# EAGLE schematic homecontroller_main_new (EAGLE 6.6.0)

## Sheet 1 of 7
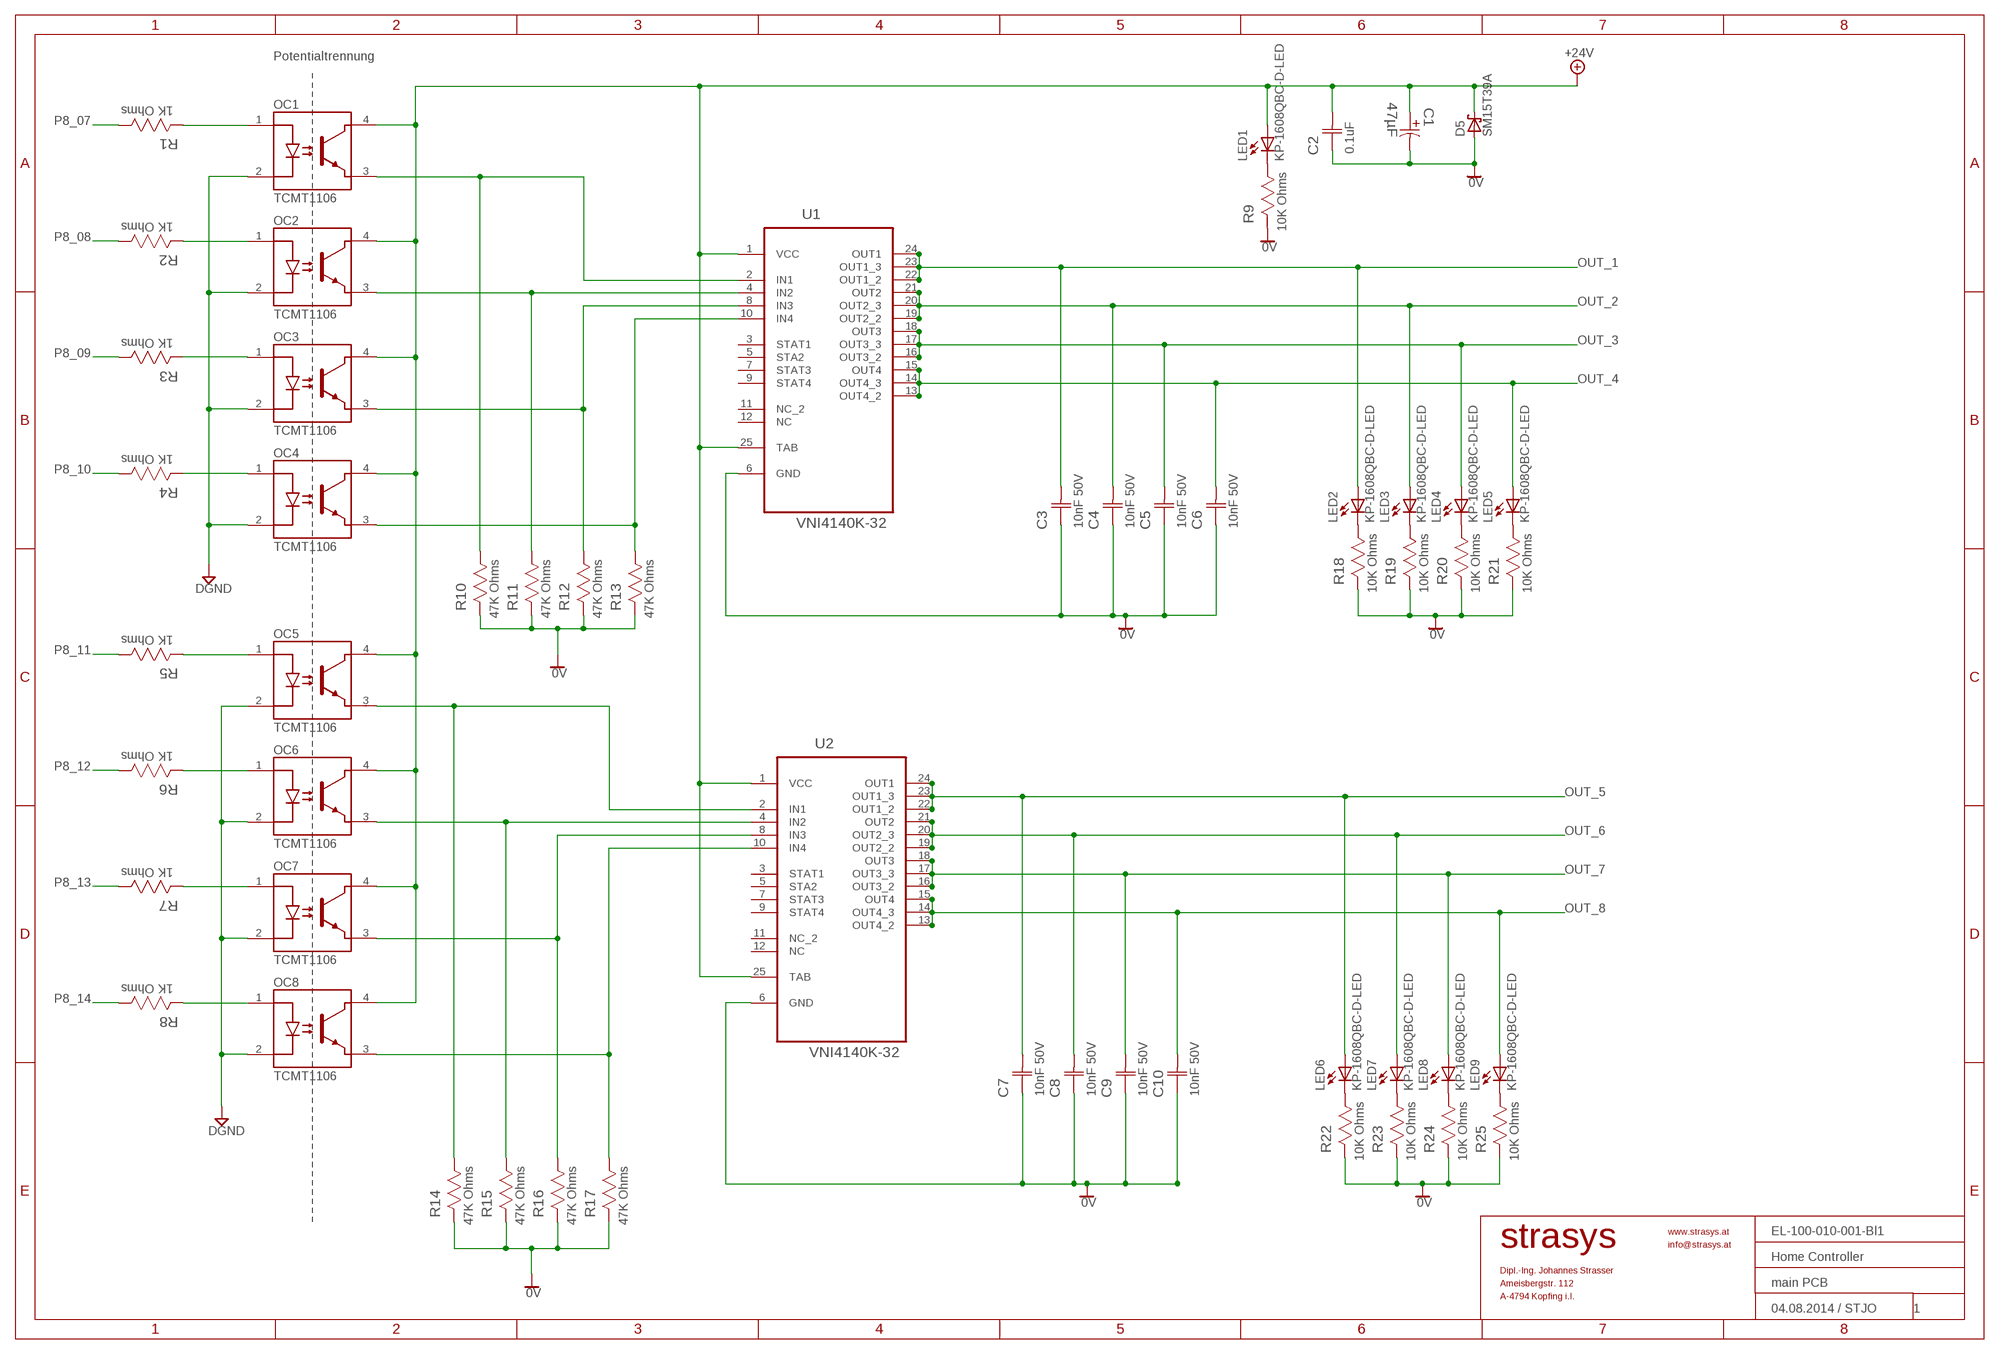
[diagram p0: schematic, sheet 1]
FRAME1 (A3L-LOC): DATE_DRAWING: 04.08.2014 / STJO; DRAWING_NAME1: Home Controller; DRAWING_NAME2: main PCB; DRAWING_NO: EL-100-010-001-Bl1; PAGE: 1

### Parts
C1  47µF  EEE-FK1H470P-CASE-E  [CAPAE830X650N]
C2  0.1uF  C0603C104K5RAC-TU  [CAPC1608X85N]
C3  10nF 50V  C0603C103K5RACTU  [CAPC1608X85N]
C4  10nF 50V  C0603C103K5RACTU  [CAPC1608X85N]
C5  10nF 50V  C0603C103K5RACTU  [CAPC1608X85N]
C6  10nF 50V  C0603C103K5RACTU  [CAPC1608X85N]
C7  10nF 50V  C0603C103K5RACTU  [CAPC1608X85N]
C8  10nF 50V  C0603C103K5RACTU  [CAPC1608X85N]
C9  10nF 50V  C0603C103K5RACTU  [CAPC1608X85N]
C10  10nF 50V  C0603C103K5RACTU  [CAPC1608X85N]
D5  SM15T39A  [SM15T39A]
LED1  KP-1608QBC-D-LED  [KP-1608QBCD-D-LED]
LED2  KP-1608QBC-D-LED  [KP-1608QBCD-D-LED]
LED3  KP-1608QBC-D-LED  [KP-1608QBCD-D-LED]
LED4  KP-1608QBC-D-LED  [KP-1608QBCD-D-LED]
LED5  KP-1608QBC-D-LED  [KP-1608QBCD-D-LED]
LED6  KP-1608QBC-D-LED  [KP-1608QBCD-D-LED]
LED7  KP-1608QBC-D-LED  [KP-1608QBCD-D-LED]
LED8  KP-1608QBC-D-LED  [KP-1608QBCD-D-LED]
LED9  KP-1608QBC-D-LED  [KP-1608QBCD-D-LED]
OC1  TCMT1106  [SOP-4]
OC2  TCMT1106  [SOP-4]
OC3  TCMT1106  [SOP-4]
OC4  TCMT1106  [SOP-4]
OC5  TCMT1106  [SOP-4]
OC6  TCMT1106  [SOP-4]
OC7  TCMT1106  [SOP-4]
OC8  TCMT1106  [SOP-4]
R1  1K Ohms  CRCW06031K00FKEA  [RESC1608X60N]
R2  1K Ohms  CRCW06031K00FKEA  [RESC1608X60N]
R3  1K Ohms  CRCW06031K00FKEA  [RESC1608X60N]
R4  1K Ohms  CRCW06031K00FKEA  [RESC1608X60N]
R5  1K Ohms  CRCW06031K00FKEA  [RESC1608X60N]
R6  1K Ohms  CRCW06031K00FKEA  [RESC1608X60N]
R7  1K Ohms  CRCW06031K00FKEA  [RESC1608X60N]
R8  1K Ohms  CRCW06031K00FKEA  [RESC1608X60N]
R9  10K Ohms  CRCW060310K0FKEA  [RESC1608X60N]
R10  47K Ohms  CRCW060347K0FKEA  [RESC1608X60N]
R11  47K Ohms  CRCW060347K0FKEA  [RESC1608X60N]
R12  47K Ohms  CRCW060347K0FKEA  [RESC1608X60N]
R13  47K Ohms  CRCW060347K0FKEA  [RESC1608X60N]
R14  47K Ohms  CRCW060347K0FKEA  [RESC1608X60N]
R15  47K Ohms  CRCW060347K0FKEA  [RESC1608X60N]
R16  47K Ohms  CRCW060347K0FKEA  [RESC1608X60N]
R17  47K Ohms  CRCW060347K0FKEA  [RESC1608X60N]
R18  10K Ohms  CRCW060310K0FKEA  [RESC1608X60N]
R19  10K Ohms  CRCW060310K0FKEA  [RESC1608X60N]
R20  10K Ohms  CRCW060310K0FKEA  [RESC1608X60N]
R21  10K Ohms  CRCW060310K0FKEA  [RESC1608X60N]
R22  10K Ohms  CRCW060310K0FKEA  [RESC1608X60N]
R23  10K Ohms  CRCW060310K0FKEA  [RESC1608X60N]
R24  10K Ohms  CRCW060310K0FKEA  [RESC1608X60N]
R25  10K Ohms  CRCW060310K0FKEA  [RESC1608X60N]
U1  VNI4140K-32  [SOP80P1030X247-25N]
U2  VNI4140K-32  [SOP80P1030X247-25N]

### Nets
0V: C1.2 C2.1(C1) C3.1(C1) C4.1(C1) C5.1(C1) C6.1(C1) C7.1(C1) C8.1(C1) C9.1(C1) C10.1(C1) D5.A R9.2 R10.2 R11.2 R12.2 R13.2 R14.2 R15.2 R16.2 R17.2 R18.2 R19.2 R20.2 R21.2 R22.2 R23.2 R24.2 R25.2 U1.6(GND) U2.6(GND) ; also sheet 2,7
+24V: C1.1 C2.2(C2) D5.K(C) LED1.1 OC1.4 OC2.4 OC3.4 OC4.4 OC5.4 OC6.4 OC7.4 OC8.4 U1.1(VCC) U1.25(TAB) U2.1(VCC) U2.25(TAB) ; also sheet 7
DGND: OC1.2 OC2.2 OC3.2 OC4.2 OC5.2 OC6.2 OC7.2 OC8.2 ; also sheet 2,3,5,6,7
N$1: LED2.2 R18.1
N$2: LED3.2 R19.1
N$3: LED4.2 R20.1
N$4: LED5.2 R21.1
N$5: LED6.2 R22.1
N$6: LED7.2 R23.1
N$7: LED8.2 R24.1
N$8: LED9.2 R25.1
N$9: OC1.3 R10.1 U1.2(IN1)
N$10: OC1.1 R1.2
N$11: OC2.1 R2.2
N$12: OC3.1 R3.2
N$13: OC4.1 R4.2
N$14: LED1.2 R9.1
N$15: OC2.3 R11.1 U1.4(IN2)
N$16: OC3.3 R12.1 U1.8(IN3)
N$17: OC4.3 R13.1 U1.10(IN4)
N$22: OC5.1 R5.2
N$23: OC6.1 R6.2
N$24: OC7.1 R7.2
N$25: OC8.1 R8.2
N$26: OC5.3 R14.1 U2.2(IN1)
N$27: OC6.3 R15.1 U2.4(IN2)
N$28: OC7.3 R16.1 U2.8(IN3)
N$29: OC8.3 R17.1 U2.10(IN4)
OUT_1: C3.2(C2) LED2.1 U1.22(OUT1_2) U1.23(OUT1_3) U1.24(OUT1) ; also sheet 7
OUT_2: C4.2(C2) LED3.1 U1.19(OUT2_2) U1.20(OUT2_3) U1.21(OUT2) ; also sheet 7
OUT_3: C5.2(C2) LED4.1 U1.16(OUT3_2) U1.17(OUT3_3) U1.18(OUT3) ; also sheet 7
OUT_4: C6.2(C2) LED5.1 U1.13(OUT4_2) U1.14(OUT4_3) U1.15(OUT4) ; also sheet 7
OUT_5: C7.2(C2) LED6.1 U2.22(OUT1_2) U2.23(OUT1_3) U2.24(OUT1) ; also sheet 7
OUT_6: C8.2(C2) LED7.1 U2.19(OUT2_2) U2.20(OUT2_3) U2.21(OUT2) ; also sheet 7
OUT_7: C9.2(C2) LED8.1 U2.16(OUT3_2) U2.17(OUT3_3) U2.18(OUT3) ; also sheet 7
OUT_8: C10.2(C2) LED9.1 U2.13(OUT4_2) U2.14(OUT4_3) U2.15(OUT4) ; also sheet 7
P8_07: R1.1 ; also sheet 7
P8_08: R2.1 ; also sheet 7
P8_09: R3.1 ; also sheet 7
P8_10: R4.1 ; also sheet 7
P8_11: R5.1 ; also sheet 7
P8_12: R6.1 ; also sheet 7
P8_13: R7.1 ; also sheet 7
P8_14: R8.1 ; also sheet 7
Unconnected: U1.3(STAT1) U1.5(STA2) U1.7(STAT3) U1.9(STAT4) U1.11(NC_2) U1.12(NC) U2.3(STAT1) U2.5(STA2) U2.7(STAT3) U2.9(STAT4) U2.11(NC_2) U2.12(NC)

### Notes on the sheet
- Potentialtrennung

## Sheet 2 of 7
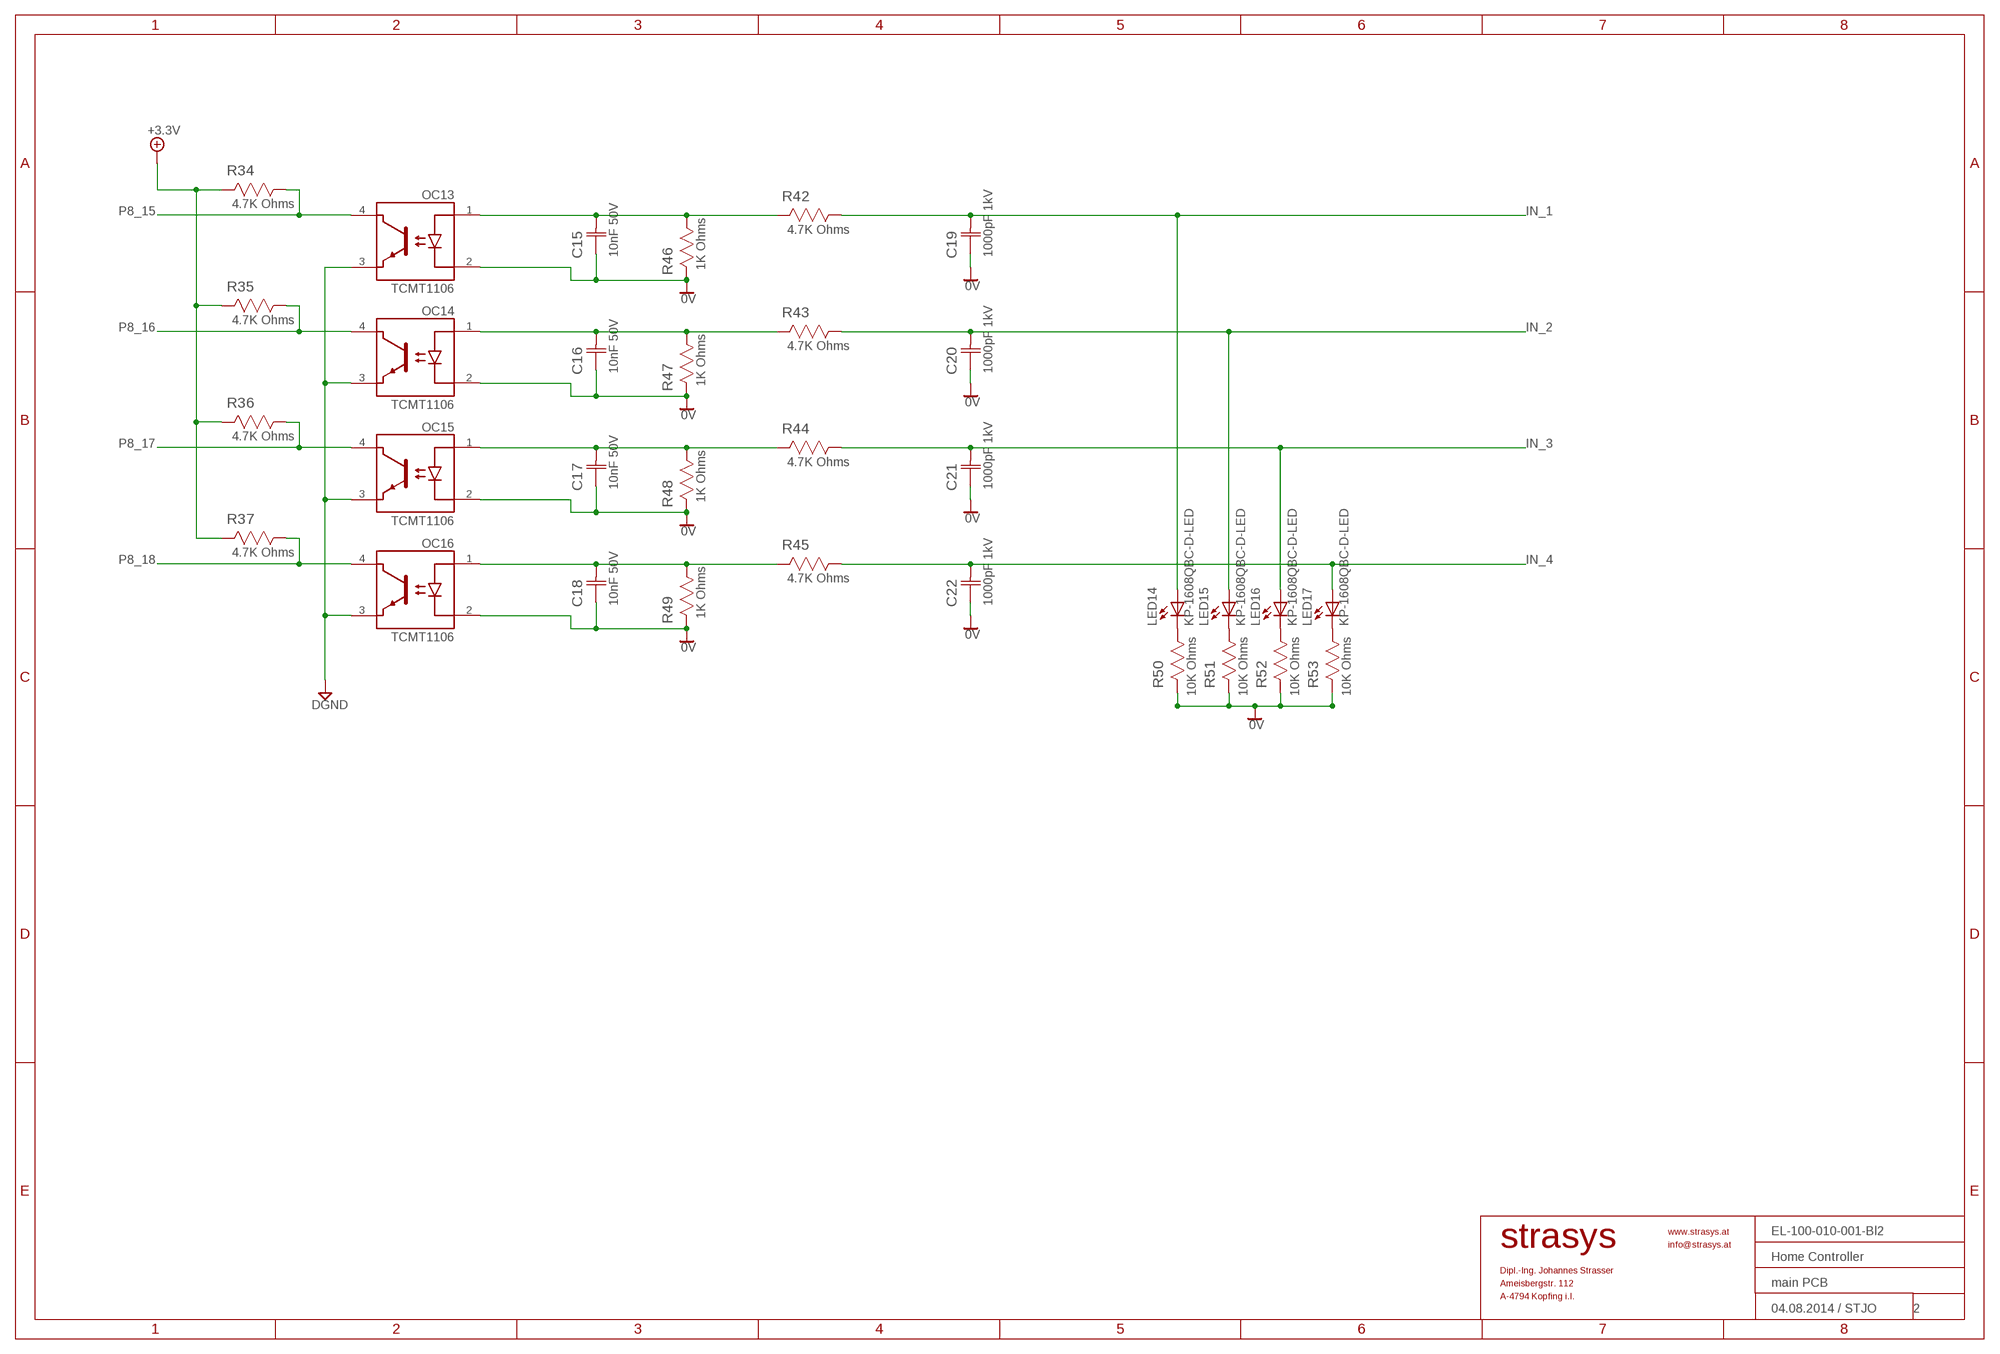
[diagram p1: schematic, sheet 2]
FRAME2 (A3L-LOC): DATE_DRAWING: 04.08.2014 / STJO; DRAWING_NAME1: Home Controller; DRAWING_NAME2: main PCB; DRAWING_NO: EL-100-010-001-Bl2; PAGE: 2

### Parts
C15  10nF 50V  C0603C103K5RACTU  [CAPC1608X85N]
C16  10nF 50V  C0603C103K5RACTU  [CAPC1608X85N]
C17  10nF 50V  C0603C103K5RACTU  [CAPC1608X85N]
C18  10nF 50V  C0603C103K5RACTU  [CAPC1608X85N]
C19  1000pF 1kV  C1206C102KDRACTU  [CAPC3216X88N]
C20  1000pF 1kV  C1206C102KDRACTU  [CAPC3216X88N]
C21  1000pF 1kV  C1206C102KDRACTU  [CAPC3216X88N]
C22  1000pF 1kV  C1206C102KDRACTU  [CAPC3216X88N]
LED14  KP-1608QBC-D-LED  [KP-1608QBCD-D-LED]
LED15  KP-1608QBC-D-LED  [KP-1608QBCD-D-LED]
LED16  KP-1608QBC-D-LED  [KP-1608QBCD-D-LED]
LED17  KP-1608QBC-D-LED  [KP-1608QBCD-D-LED]
OC13  TCMT1106  [SOP-4]
OC14  TCMT1106  [SOP-4]
OC15  TCMT1106  [SOP-4]
OC16  TCMT1106  [SOP-4]
R34  4.7K Ohms  CRCW06034K70FKEA  [RESC1608X60N]
R35  4.7K Ohms  CRCW06034K70FKEA  [RESC1608X60N]
R36  4.7K Ohms  CRCW06034K70FKEA  [RESC1608X60N]
R37  4.7K Ohms  CRCW06034K70FKEA  [RESC1608X60N]
R42  4.7K Ohms  CRCW06034K70FKEA  [RESC1608X60N]
R43  4.7K Ohms  CRCW06034K70FKEA  [RESC1608X60N]
R44  4.7K Ohms  CRCW06034K70FKEA  [RESC1608X60N]
R45  4.7K Ohms  CRCW06034K70FKEA  [RESC1608X60N]
R46  1K Ohms  CRCW06031K00FKEA  [RESC1608X60N]
R47  1K Ohms  CRCW06031K00FKEA  [RESC1608X60N]
R48  1K Ohms  CRCW06031K00FKEA  [RESC1608X60N]
R49  1K Ohms  CRCW06031K00FKEA  [RESC1608X60N]
R50  10K Ohms  CRCW060310K0FKEA  [RESC1608X60N]
R51  10K Ohms  CRCW060310K0FKEA  [RESC1608X60N]
R52  10K Ohms  CRCW060310K0FKEA  [RESC1608X60N]
R53  10K Ohms  CRCW060310K0FKEA  [RESC1608X60N]

### Nets
0V: C15.1(C1) C16.1(C1) C17.1(C1) C18.1(C1) C19.1(C1) C20.1(C1) C21.1(C1) C22.1(C1) OC13.2 OC14.2 OC15.2 OC16.2 R46.2 R47.2 R48.2 R49.2 R50.2 R51.2 R52.2 R53.2 ; also sheet 1,7
+3.3V: R34.2 R35.2 R36.2 R37.2 ; also sheet 3,5,6,7
DGND: OC13.3 OC14.3 OC15.3 OC16.3 ; also sheet 1,3,5,6,7
IN_1: C19.2(C2) LED14.1 R42.1 ; also sheet 7
IN_2: C20.2(C2) LED15.1 R43.1 ; also sheet 7
IN_3: C21.2(C2) LED16.1 R44.1 ; also sheet 7
IN_4: C22.2(C2) LED17.1 R45.1 ; also sheet 7
N$30: LED14.2 R50.1
N$31: LED15.2 R51.1
N$32: LED16.2 R52.1
N$33: LED17.2 R53.1
N$34: C15.2(C2) OC13.1 R42.2 R46.1
N$36: C16.2(C2) OC14.1 R43.2 R47.1
N$42: C17.2(C2) OC15.1 R44.2 R48.1
N$49: C18.2(C2) OC16.1 R45.2 R49.1
P8_15: OC13.4 R34.1 ; also sheet 7
P8_16: OC14.4 R35.1 ; also sheet 7
P8_17: OC15.4 R36.1 ; also sheet 7
P8_18: OC16.4 R37.1 ; also sheet 7

## Sheet 3 of 7
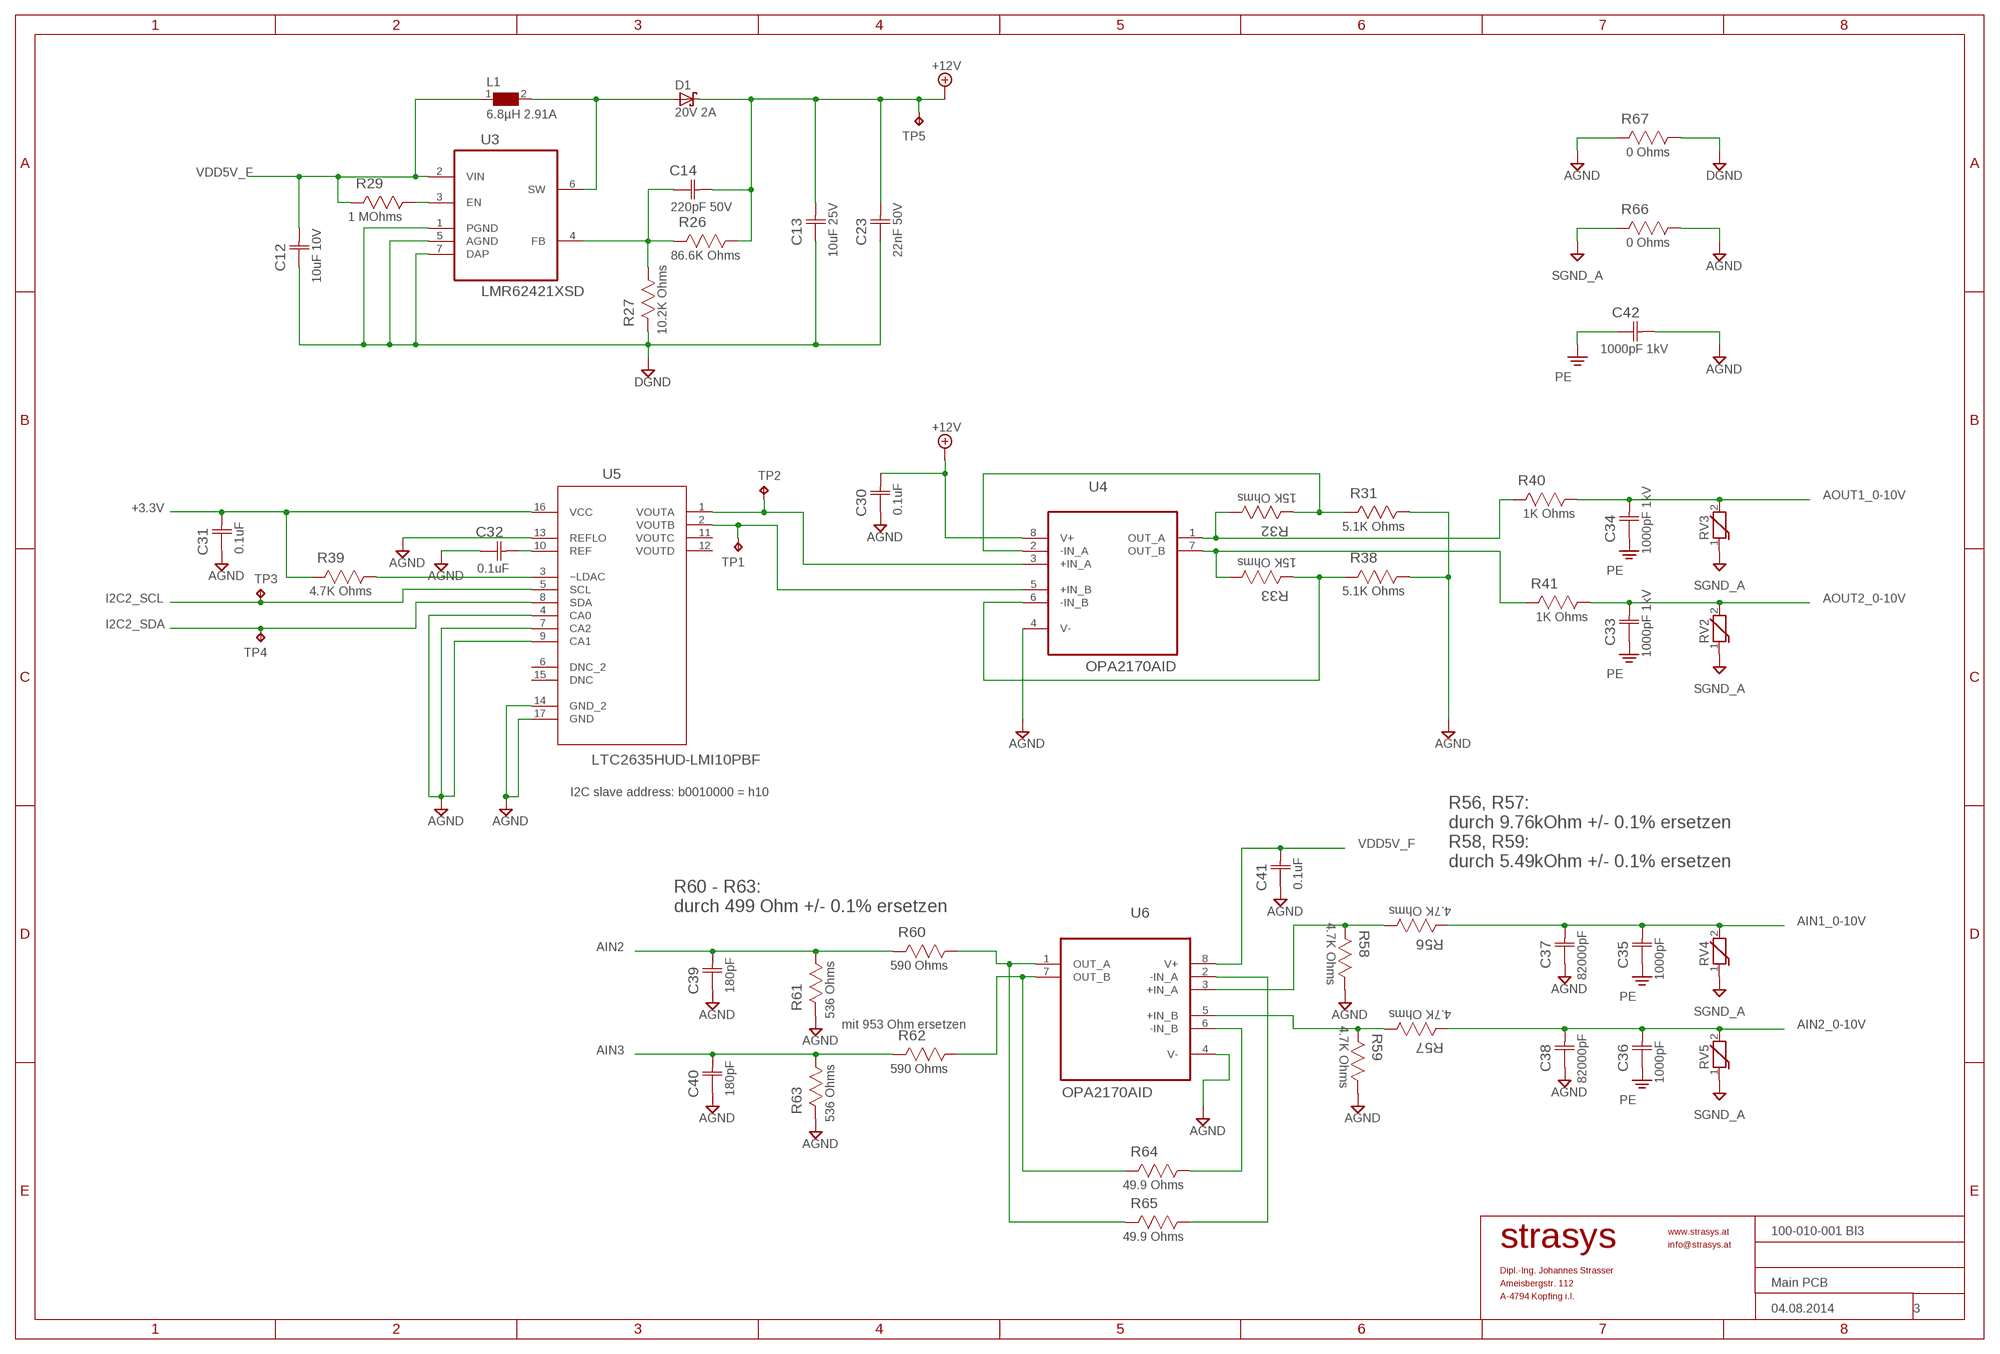
[diagram p2: schematic, sheet 3]
FRAME4 (A3L-LOC): DATE_DRAWING: 04.08.2014; DRAWING_NAME1: Home Controller; DRAWING_NAME2: Main PCB; DRAWING_NO: 100-010-001 Bl3; PAGE: 3

### Parts
C12  10uF 10V  C0805C106K8PACTU  [CAPC2013X140N]
C13  10uF 25V  C1206C106K3PACTU  [CAPC3216X180N]
C14  220pF 50V  C0603C221J5GACTU  [CAPC1608X85N]
C23  22nF 50V  C0603C223K5RACTU  [CAPC1608X85N]
C30  0.1uF  C0603C104K5RAC-TU  [CAPC1608X85N]
C31  0.1uF  C0603C104K5RAC-TU  [CAPC1608X85N]
C32  0.1uF  C0603C104K5RAC-TU  [CAPC1608X85N]
C33  1000pF 1kV  C1206C102KDRACTU  [CAPC3216X88N]
C34  1000pF 1kV  C1206C102KDRACTU  [CAPC3216X88N]
C35  1000pF  C1206C102KDRACTU  [CAPC3216X88N]
C36  1000pF  C1206C102KDRACTU  [CAPC3216X88N]
C37  82000pF  C0603C823K5RACTU  [CAPC1608X85N]
C38  82000pF  C0603C823K5RACTU  [CAPC1608X85N]
C39  180pF  C0603C181J2GACTU  [CAPC1608X85N]
C40  180pF  C0603C181J2GACTU  [CAPC1608X85N]
C41  0.1uF  C0603C104K5RAC-TU  [CAPC1608X85N]
C42  1000pF 1kV  C1206C102KDRACTU  [CAPC3216X88N]
D1  20V 2A  SCHOTTKY-DIODESMD  [SMB]
L1  6.8µH 2.91A  WE-PD-7447779006_7332/7345_PLASTIC_BASE  [WE-PD_7332/7345_PLASTIC_BASE]
R26  86.6K Ohms  CRCW060386K6FKEA  [RESC1608X60N]
R27  10.2K Ohms  CRCW060310K2FKEA  [RESC1608X60N]
R29  1 MOhms  CRCW06031M00FKEA  [RESC1608X60N]
R31  5.1K Ohms  CRCW06035K10FKEA  [RESC1608X60N]
R32  15K Ohms  CRCW060315K0FKEA  [RESC1608X60N]
R33  15K Ohms  CRCW060315K0FKEA  [RESC1608X60N]
R38  5.1K Ohms  CRCW06035K10FKEA  [RESC1608X60N]
R39  4.7K Ohms  CRCW06034K70FKEA  [RESC1608X60N]
R40  1K Ohms  CRCW06031K00FKEA  [RESC1608X60N]
R41  1K Ohms  CRCW06031K00FKEA  [RESC1608X60N]
R56  4.7K Ohms  CRCW06034K70FKEA  [RESC1608X60N]
R57  4.7K Ohms  CRCW06034K70FKEA  [RESC1608X60N]
R58  4.7K Ohms  CRCW06034K70FKEA  [RESC1608X60N]
R59  4.7K Ohms  CRCW06034K70FKEA  [RESC1608X60N]
R60  590 Ohms  CRCW0603590RFKEA  [RESC1608X60N]
R61  536 Ohms  CRCW0603536RFKEA  [RESC1608X60N]
R62  590 Ohms  CRCW0603590RFKEA  [RESC1608X60N]
R63  536 Ohms  CRCW0603536RFKEA  [RESC1608X60N]
R64  49.9 Ohms  CRCW060349R9FKEA  [RESC1608X60N]
R65  49.9 Ohms  CRCW060349R9FKEA  [RESC1608X60N]
R66  0 Ohms  CRCW12060000Z0EA  [RESC3216X71N]
R67  0 Ohms  CRCW12060000Z0EA  [RESC3216X71N]
RV2  WE-VS-82536140_0603  [WESURGE_0603]
RV3  WE-VS-82536140_0603  [WESURGE_0603]
RV4  WE-VS-82536140_0603  [WESURGE_0603]
RV5  WE-VS-82536140_0603  [WESURGE_0603]
TP1  TPB1,27  [B1,27]
TP2  TPB1,27  [B1,27]
TP3  TPB1,27  [B1,27]
TP4  TPB1,27  [B1,27]
TP5  TPB1,27  [B1,27]
U3  LMR62421XSD  [DFN300X300X80-7N]
U4  OPA2170AID  [SOIC127P600X175-8N]
U5  LTC2635HUD-LMI10PBF  [QFN50P300X300X80-17N]
U6  OPA2170AID  [SOIC127P600X175-8N]

### Nets
+3.3V: C31.2(C2) R39.2 U5.16(VCC) ; also sheet 2,5,6,7
+12V: C13.2(C2) C14.2(C2) C23.2(C2) C30.2(C2) D1.C R26.1 TP5.TP U4.8(V+)
AGND: C30.1(C1) C31.1(C1) C32.1(C1) C37.1(C1) C38.1(C1) C39.1(C1) C40.1(C1) C41.1(C1) C42.2(C2) R31.1 R38.1 R58.1 R59.1 R61.2 R63.2 R66.1 R67.2 U4.4(V-) U5.4(CA0) U5.7(CA2) U5.9(CA1) U5.13(REFLO) U5.14(GND_2) U5.17(GND) U6.4(V-) ; also sheet 4,7
AIN1_0-10V: C35.2(C2) C37.2(C2) R56.2 RV4.2 ; also sheet 7
AIN2: C39.2(C2) R60.2 R61.1 ; also sheet 7
AIN2_0-10V: C36.2(C2) C38.2(C2) R57.2 RV5.2 ; also sheet 7
AIN3: C40.2(C2) R62.2 R63.1 ; also sheet 7
AOUT1_0-10V: C34.2(C2) R40.1 RV3.2 ; also sheet 7
AOUT2_0-10V: C33.2(C2) R41.1 RV2.2 ; also sheet 7
DGND: C12.1(C1) C13.1(C1) C23.1(C1) R27.2 R67.1 U3.1(PGND) U3.5(AGND) U3.7(DAP) ; also sheet 1,2,5,6,7
FB_LMR62: C14.1(C1) R26.2 R27.1 U3.4(FB)
I2C2_SCL: TP3.TP U5.5(SCL) ; also sheet 6,7
I2C2_SDA: TP4.TP U5.8(SDA) ; also sheet 6,7
LDAC: R39.1 U5.3(~LDAC)
N$21: R56.1 R58.2 U6.3(+IN_A)
N$39: R29.1 U3.3(EN)
N$45: R57.1 R59.2 U6.5(+IN_B)
N$50: C32.2(C2) U5.10(REF)
OPA21_-IN_A: R31.2 R32.2 U4.2(-IN_A)
OPA21_-IN_B: R33.2 R38.2 U4.6(-IN_B)
OPA21_AOUTB: R33.1 R41.2 U4.7(OUT_B)
OPA21_OUT_A: R32.1 R40.2 U4.1(OUT_A)
OPA2170_-IN_A_2: R65.1 U6.2(-IN_A)
OPA2170_-IN_B_2: R64.1 U6.6(-IN_B)
OPA2170_OUT_A_2: R60.1 R65.2 U6.1(OUT_A)
OPA2170_OUT_B_2: R62.1 R64.2 U6.7(OUT_B)
PE: C33.1(C1) C34.1(C1) C35.1(C1) C36.1(C1) C42.1(C1) ; also sheet 4,5,7
SGND_A: R66.2 RV2.1 RV3.1 RV4.1 RV5.1 ; also sheet 4
SW_LMR62: D1.A L1.2 U3.6(SW)
VDD5V_F: C12.2(C2) C41.2(C2) L1.1 R29.2 U3.2(VIN) U6.8(V+) ; also sheet 4,5,7
VOUTA: TP2.TP U4.3(+IN_A) U5.1(VOUTA)
VOUTB: TP1.TP U4.5(+IN_B) U5.2(VOUTB)
Unconnected: U5.6(DNC_2) U5.11(VOUTC) U5.12(VOUTD) U5.15(DNC)

### Notes on the sheet
- I2C slave address: b0010000 = h10
- R56, R57:
  durch 9.76kOhm +/- 0.1% ersetzen
  R58, R59:
  durch 5.49kOhm +/- 0.1% ersetzen
- R60 - R63:
  durch 499 Ohm +/- 0.1% ersetzen
- mit 953 Ohm ersetzen

## Sheet 4 of 7
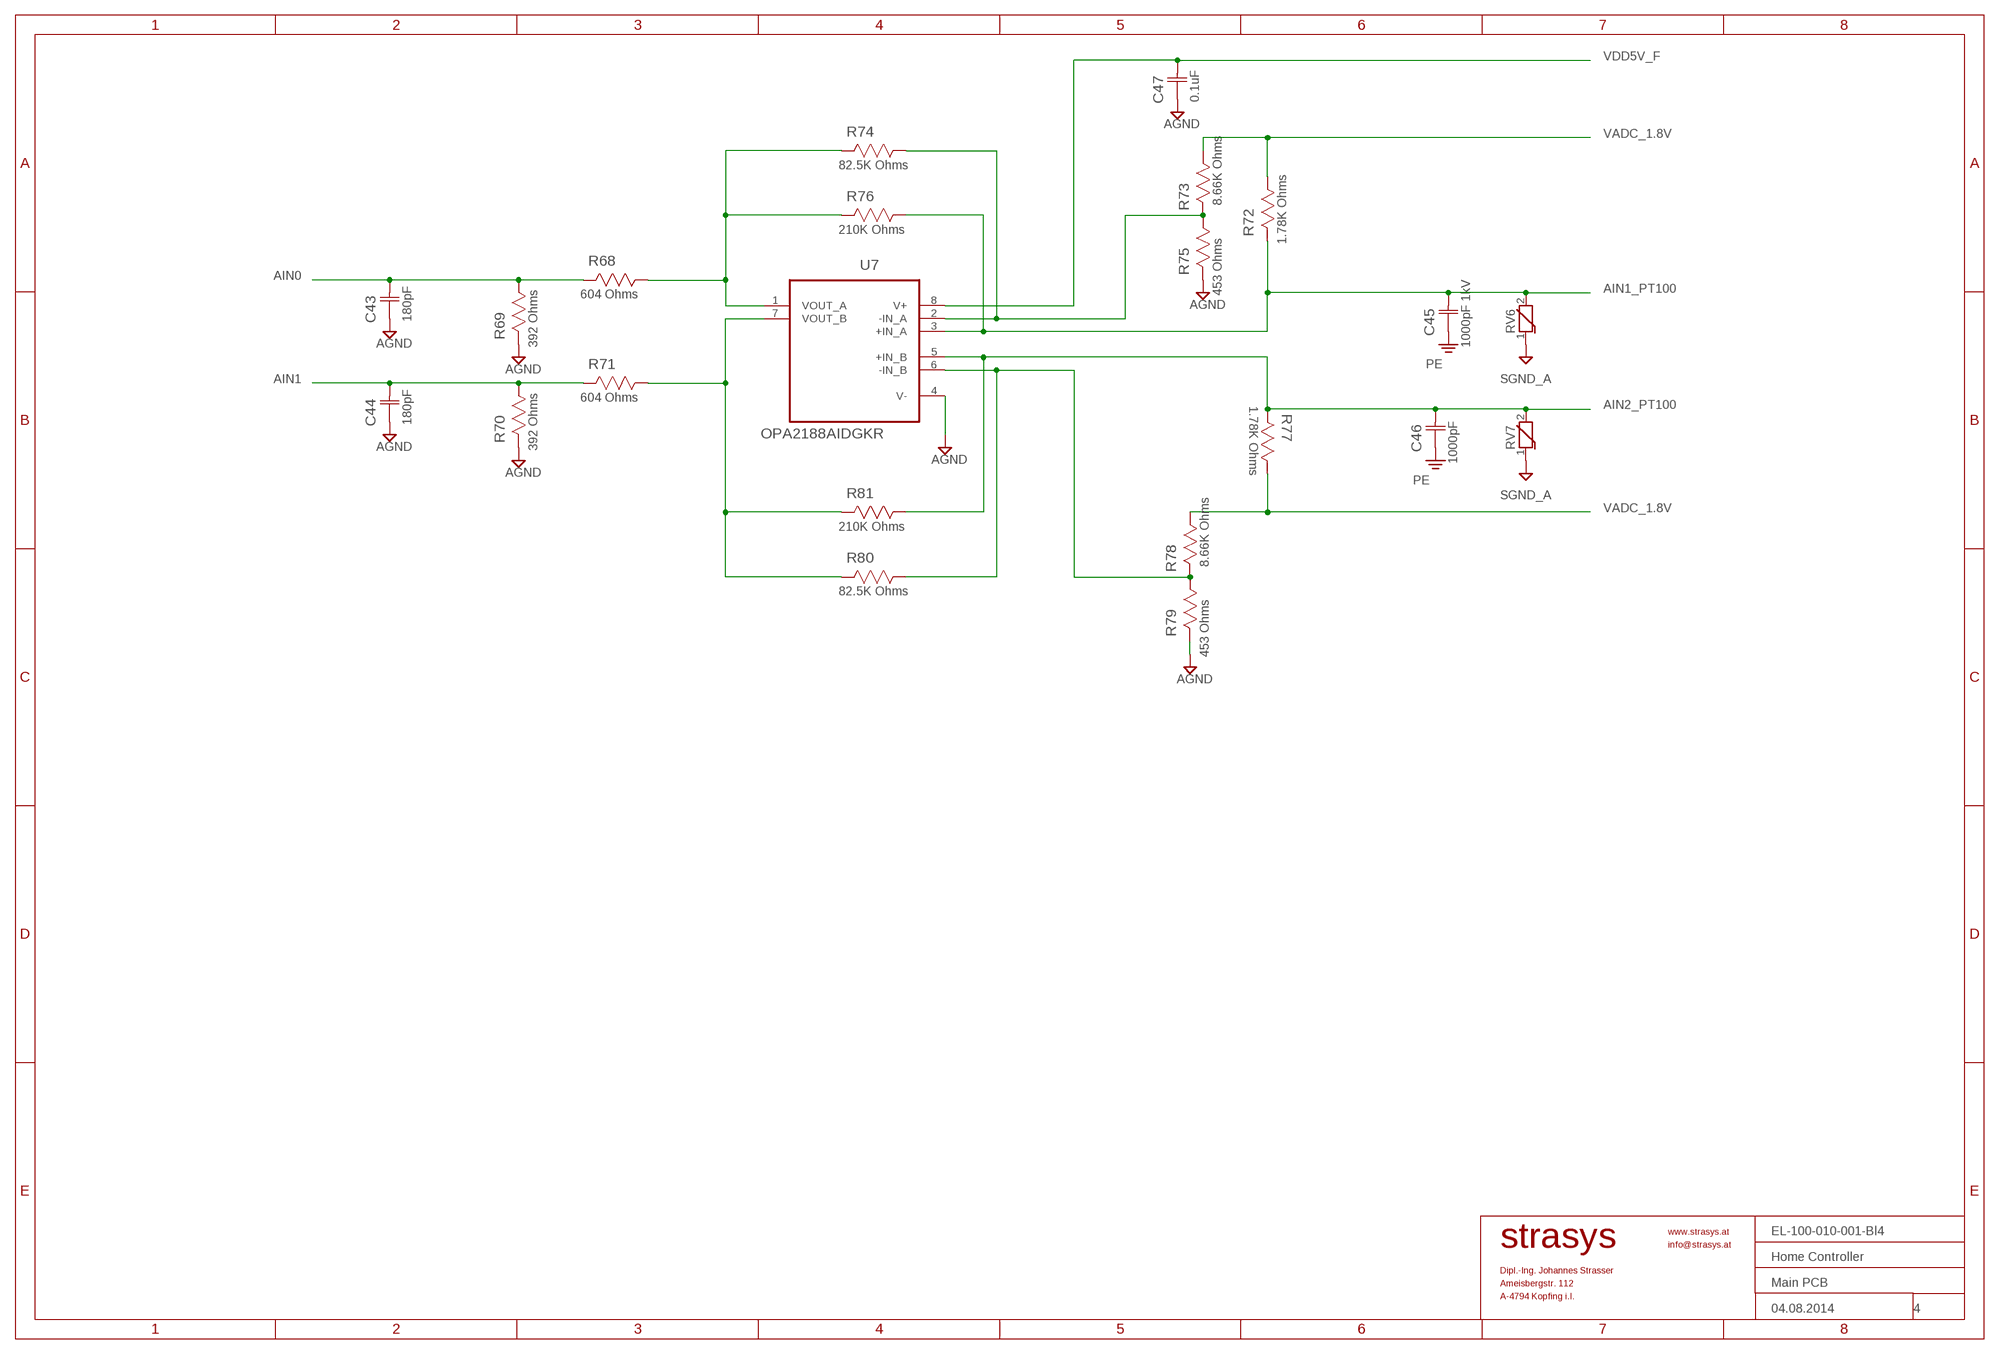
[diagram p3: schematic, sheet 4]
FRAME6 (A3L-LOC): DATE_DRAWING: 04.08.2014; DRAWING_NAME1: Home Controller; DRAWING_NAME2: Main PCB; DRAWING_NO: EL-100-010-001-Bl4; PAGE: 4

### Parts
C43  180pF  C0603C181J2GACTU  [CAPC1608X85N]
C44  180pF  C0603C181J2GACTU  [CAPC1608X85N]
C45  1000pF 1kV  C1206C102KDRACTU  [CAPC3216X88N]
C46  1000pF  C1206C102KDRACTU  [CAPC3216X88N]
C47  0.1uF  C0603C104K5RAC-TU  [CAPC1608X85N]
R68  604 Ohms  CRCW0603604RFKEA  [RESC1608X60N]
R69  392 Ohms  CRCW0603392RFKEA  [RESC1608X60N]
R70  392 Ohms  CRCW0603392RFKEA  [RESC1608X60N]
R71  604 Ohms  CRCW0603604RFKEA  [RESC1608X60N]
R72  1.78K Ohms  CRCW06031K78FKEA  [RESC1608X60N]
R73  8.66K Ohms  CRCW06038K66FKEA  [RESC1608X60N]
R74  82.5K Ohms  CRCW060382K5FKEA  [RESC1608X60N]
R75  453 Ohms  CRCW0603453RFKEA  [RESC1608X60N]
R76  210K Ohms  CRCW0603210KFKEA  [RESC1608X60N]
R77  1.78K Ohms  CRCW06031K78FKEA  [RESC1608X60N]
R78  8.66K Ohms  CRCW06038K66FKEA  [RESC1608X60N]
R79  453 Ohms  CRCW0603453RFKEA  [RESC1608X60N]
R80  82.5K Ohms  CRCW060382K5FKEA  [RESC1608X60N]
R81  210K Ohms  CRCW0603210KFKEA  [RESC1608X60N]
RV6  WE-VS-82536140_0603  [WESURGE_0603]
RV7  WE-VS-82536140_0603  [WESURGE_0603]
U7  OPA2188AIDGKR  [SOP65P490X110-8N]

### Nets
AGND: C43.1(C1) C44.1(C1) C47.1(C1) R69.2 R70.2 R75.2 R79.2 U7.4(V-) ; also sheet 3,7
AIN0: C43.2(C2) R68.2 R69.1 ; also sheet 7
AIN1: C44.2(C2) R70.1 R71.2 ; also sheet 7
AIN1_PT100: C45.2(C2) R72.2 R76.1 RV6.2 U7.3(+IN_A) ; also sheet 7
AIN2_PT100: C46.2(C2) R77.2 R81.1 RV7.2 U7.5(+IN_B) ; also sheet 7
OPA2188_-IN_A: R73.2 R74.1 R75.1 U7.2(-IN_A)
OPA2188_-IN_B: R78.2 R79.1 R80.1 U7.6(-IN_B)
OPA2188_VOUT_A: R68.1 R74.2 R76.2 U7.1(VOUT_A)
OPA2188_VOUT_B: R71.1 R80.2 R81.2 U7.7(VOUT_B)
PE: C45.1(C1) C46.1(C1) ; also sheet 3,5,7
SGND_A: RV6.1 RV7.1 ; also sheet 3
VADC_1.8V: R72.1 R73.1 R77.1 R78.1 ; also sheet 7
VDD5V_F: C47.2(C2) U7.8(V+) ; also sheet 3,5,7

## Sheet 5 of 7
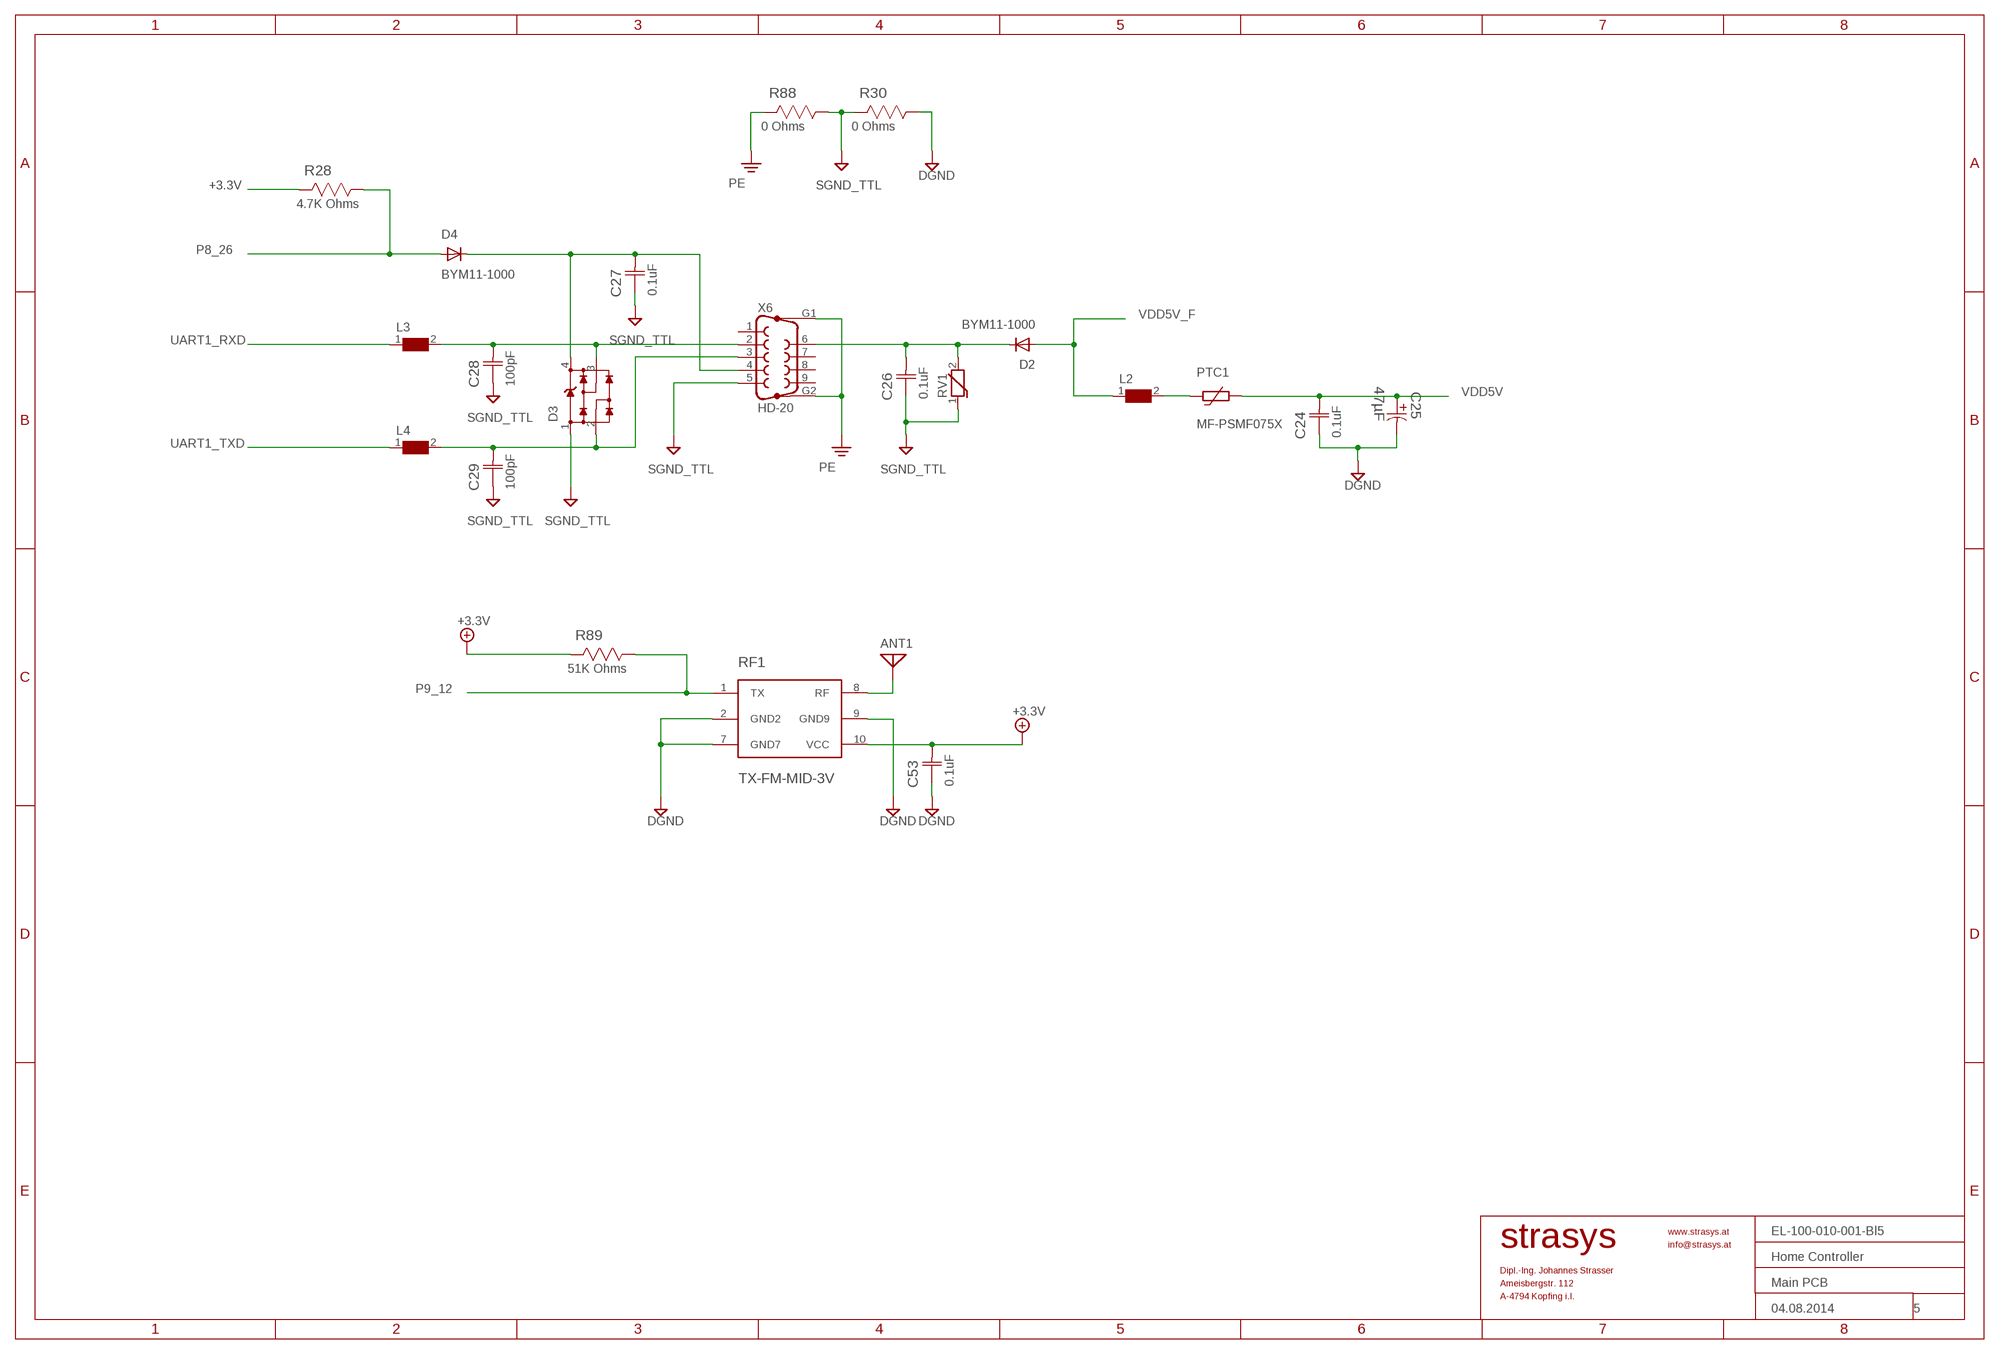
[diagram p4: schematic, sheet 5]
FRAME5 (A3L-LOC): DATE_DRAWING: 04.08.2014; DRAWING_NAME1: Home Controller; DRAWING_NAME2: Main PCB; DRAWING_NO: EL-100-010-001-Bl5; PAGE: 5

### Parts
ANT1  ANTENNA  [PAD-01]
C24  0.1uF  C0603C104K5RAC-TU  [CAPC1608X85N]
C25  47µF  EEE-FK1H470P-CASE-E  [CAPAE830X650N]
C26  0.1uF  C0603C104K5RAC-TU  [CAPC1608X85N]
C27  0.1uF  C0603C104K5RAC-TU  [CAPC1608X85N]
C28  100pF  C0603C101J5GACTU  [CAPC1608X85N]
C29  100pF  C0603C101J5GACTU  [CAPC1608X85N]
C53  0.1uF  C0603C104K5RAC-TU  [CAPC1608X85N]
D2  BYM11-1000  [DO-213AB]
D3  WE-TVS_8240136  [WE-TVS_SOT143-4L]
D4  BYM11-1000  [DO-213AB]
L2  WE-CBF-74279218_1206  [1206]
L3  WE-CBF-74279263_0603  [0603]
L4  WE-CBF-74279263_0603  [0603]
PTC1  MF-PSMF075X  [MF-PSMF]
R28  4.7K Ohms  CRCW06034K70FKEA  [RESC1608X60N]
R30  0 Ohms  CRCW12060000Z0EA  [RESC3216X71N]
R88  0 Ohms  CRCW12060000Z0EA  [RESC3216X71N]
R89  51K Ohms  CRCW060351K0FKEA  [RESC1608X60N]
RF1  TX-FM-MID-3V  [TX_SAW_MID]
RV1  WE-VS-82536040_0603  [WESURGE_0603]
X6  HD-20  [SUB-D_HD-20]

### Nets
+3.3V: C53.2(C2) R28.2 R89.2 RF1.10(VCC) ; also sheet 2,3,6,7
+5V: C26.2(C2) D2.C RV1.2 X6.6
DGND: C24.1(C1) C25.2 C53.1(C1) R30.1 RF1.2(GND2) RF1.7(GND7) RF1.9(GND9) ; also sheet 1,2,3,6,7
N$18: ANT1.1 RF1.8(RF)
N$20: L2.2 PTC1.P$1
P8_26: D4.A R28.1 ; also sheet 7
P9_12: R89.1 RF1.1(TX) ; also sheet 7
PE: R88.2 X6.G1 X6.G2 ; also sheet 3,4,7
RESET: C27.2(C2) D3.4(VDD) D4.C X6.4
SGND_TTL: C26.1(C1) C27.1(C1) C28.1(C1) C29.1(C1) D3.1(GND) R30.2 R88.1 RV1.1 X6.5
UART1_RXD: L3.1 ; also sheet 7
UART1_RXD_S: C28.2(C2) D3.3 L3.2 X6.2
UART1_TXD: L4.1 ; also sheet 7
UART1_TXD_S: C29.2(C2) D3.2 L4.2 X6.3
VDD5V: C24.2(C2) C25.1 PTC1.P$2 ; also sheet 7
VDD5V_F: D2.A L2.1 ; also sheet 3,4,7
Unconnected: X6.1 X6.7 X6.8 X6.9

## Sheet 6 of 7
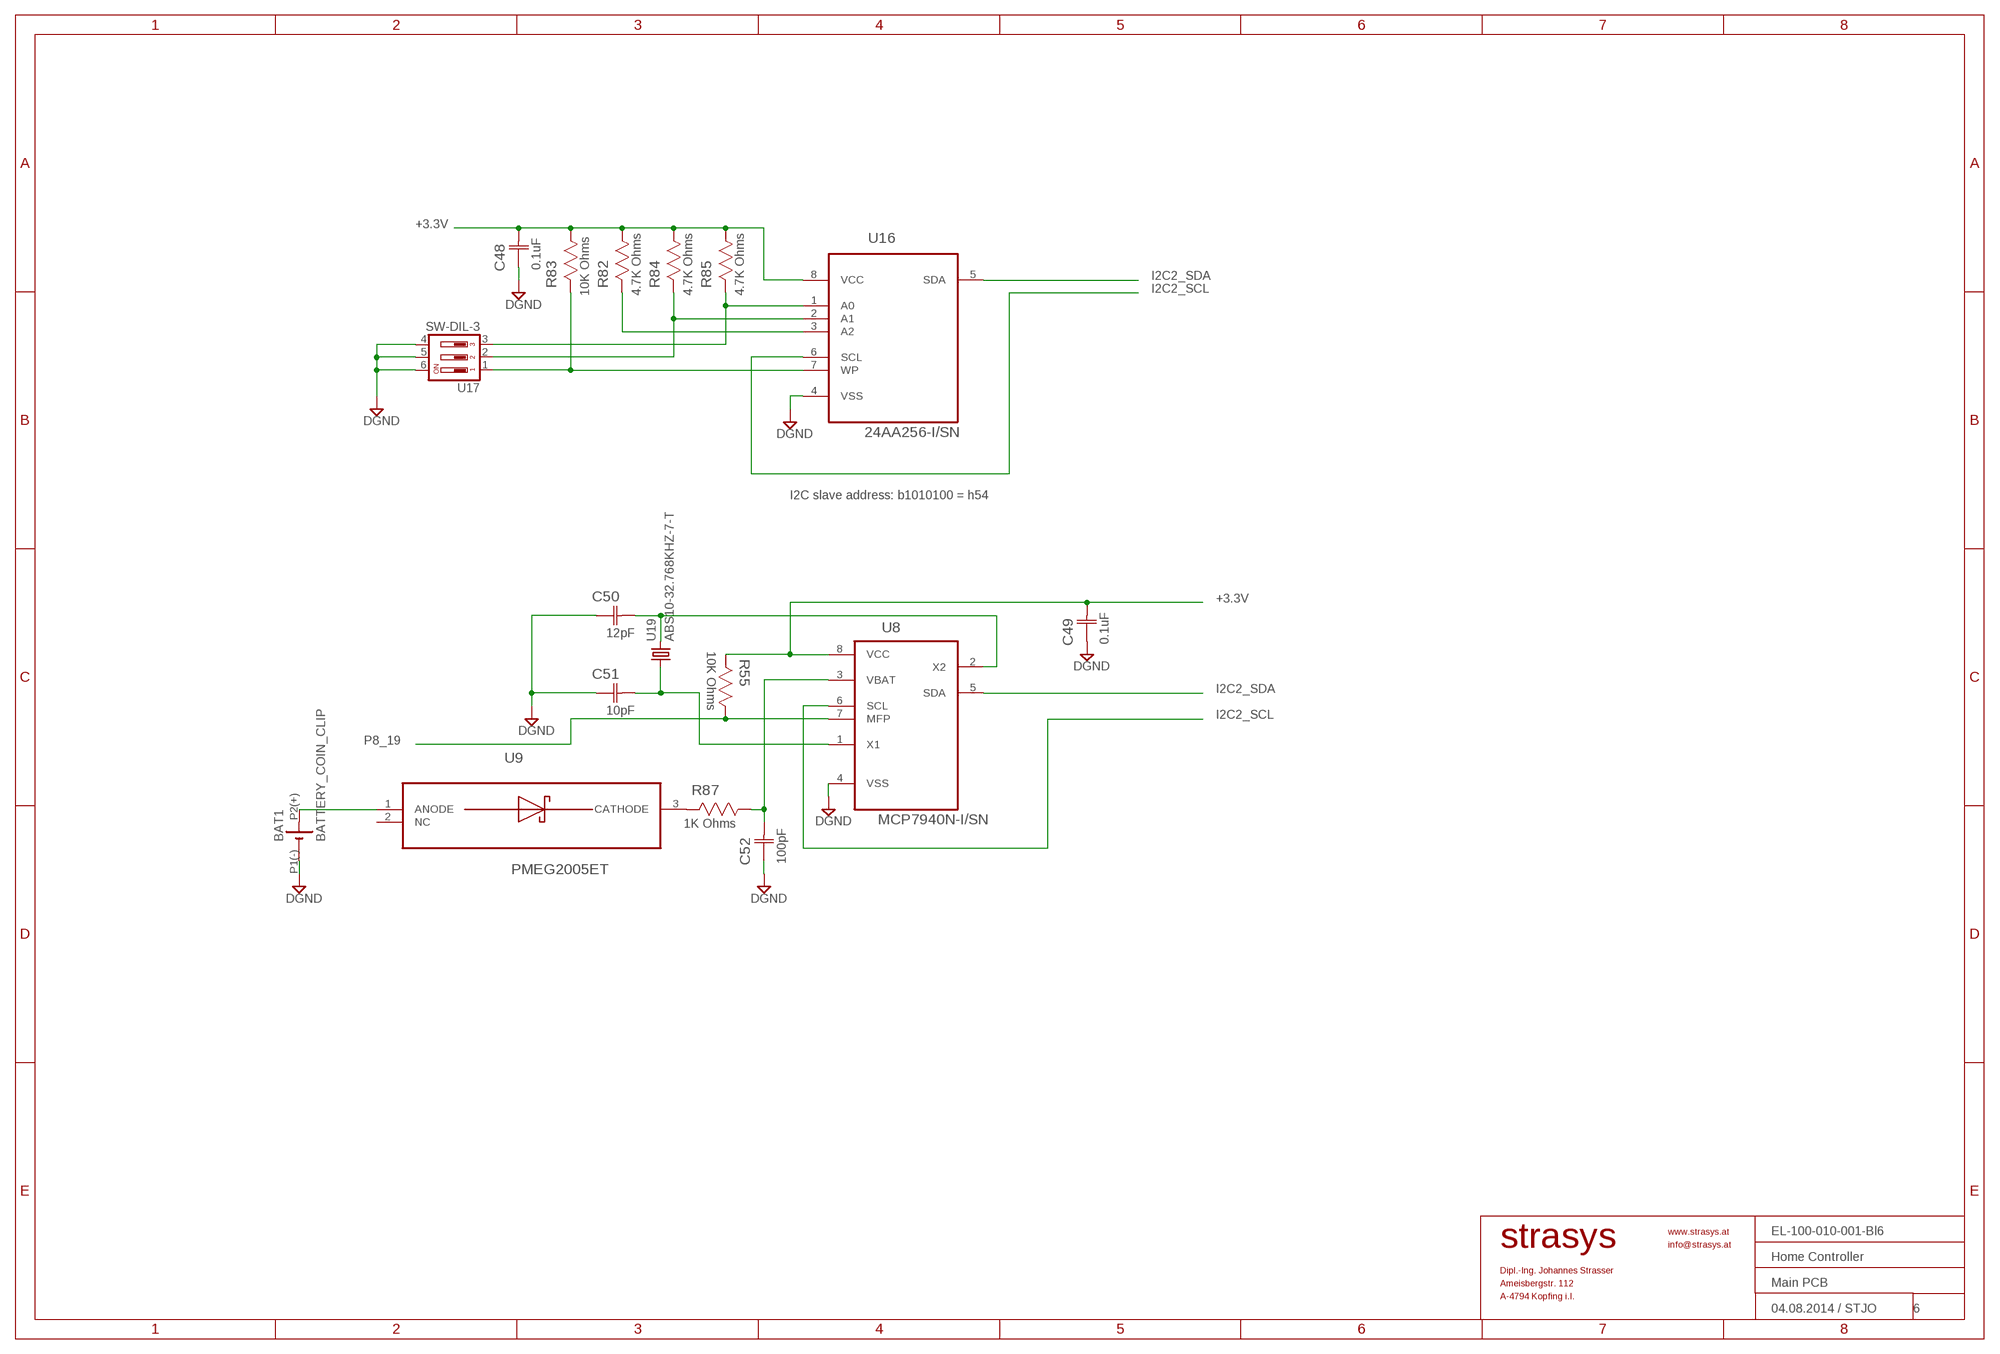
[diagram p5: schematic, sheet 6]
FRAME7 (A3L-LOC): DATE_DRAWING: 04.08.2014 / STJO; DRAWING_NAME1: Home Controller; DRAWING_NAME2: Main PCB; DRAWING_NO: EL-100-010-001-Bl6; PAGE: 6

### Parts
BAT1  BATTERY_COIN_CLIP  [BAT_HOLDER_16MM]
C48  0.1uF  C0603C104K5RAC-TU  [CAPC1608X85N]
C49  0.1uF  C0603C104K5RAC-TU  [CAPC1608X85N]
C50  12pF  C0603C120J5GACTU  [CAPC1608X85N]
C51  10pF  C0603C100J5GACTU  [CAPC1608X85N]
C52  100pF  C0603C101J5GACTU  [CAPC1608X85N]
R55  10K Ohms  CRCW060310K0FKEA  [RESC1608X60N]
R82  4.7K Ohms  CRCW06034K70FKEA  [RESC1608X60N]
R83  10K Ohms  CRCW060310K0FKEA  [RESC1608X60N]
R84  4.7K Ohms  CRCW06034K70FKEA  [RESC1608X60N]
R85  4.7K Ohms  CRCW06034K70FKEA  [RESC1608X60N]
R87  1K Ohms  CRCW06031K00FKEA  [RESC1608X60N]
U8  MCP7940N-I/SN  [SOIC127P600X175-8N]
U9  PMEG2005ET  [SOT95P280X145-5N]
U16  24AA256-I/SN  [SOIC127P600X175-8N]
U17  SW-DIL-3  [DS-03]
U19  ABS10-32.768KHZ-7-T  [ABS-10]

### Nets
24AA_A0: R85.2 U16.1(A0) U17.3
24AA_A1: R84.2 U16.2(A1) U17.2
24AA_WP: R83.2 U16.7(WP) U17.1
+3.3V: C48.2(C2) C49.2(C2) R55.2 R82.1 R83.1 R84.1 R85.1 U8.8(VCC) U16.8(VCC) ; also sheet 2,3,5,7
DGND: BAT1.P1(-)(-) C48.1(C1) C49.1(C1) C50.1(C1) C51.1(C1) C52.1(C1) U8.4(VSS) U16.4(VSS) U17.4 U17.5 U17.6 ; also sheet 1,2,3,5,7
I2C2_SCL: U8.6(SCL) U16.6(SCL) ; also sheet 3,7
I2C2_SDA: U8.5(SDA) U16.5(SDA) ; also sheet 3,7
N$19: R82.2 U16.3(A2)
N$35: BAT1.P2(+)(+) U9.1(ANODE)
N$46: R87.2 U9.3(CATHODE)
N$47: C52.2(C2) R87.1 U8.3(VBAT)
N$48: C50.2(C2) U8.2(X2) U19.P$2
N$51: C51.2(C2) U8.1(X1) U19.P$1
P8_19: R55.1 U8.7(MFP) ; also sheet 7
Unconnected: U9.2(NC)

### Notes on the sheet
- I2C slave address: b1010100 = h54

## Sheet 7 of 7
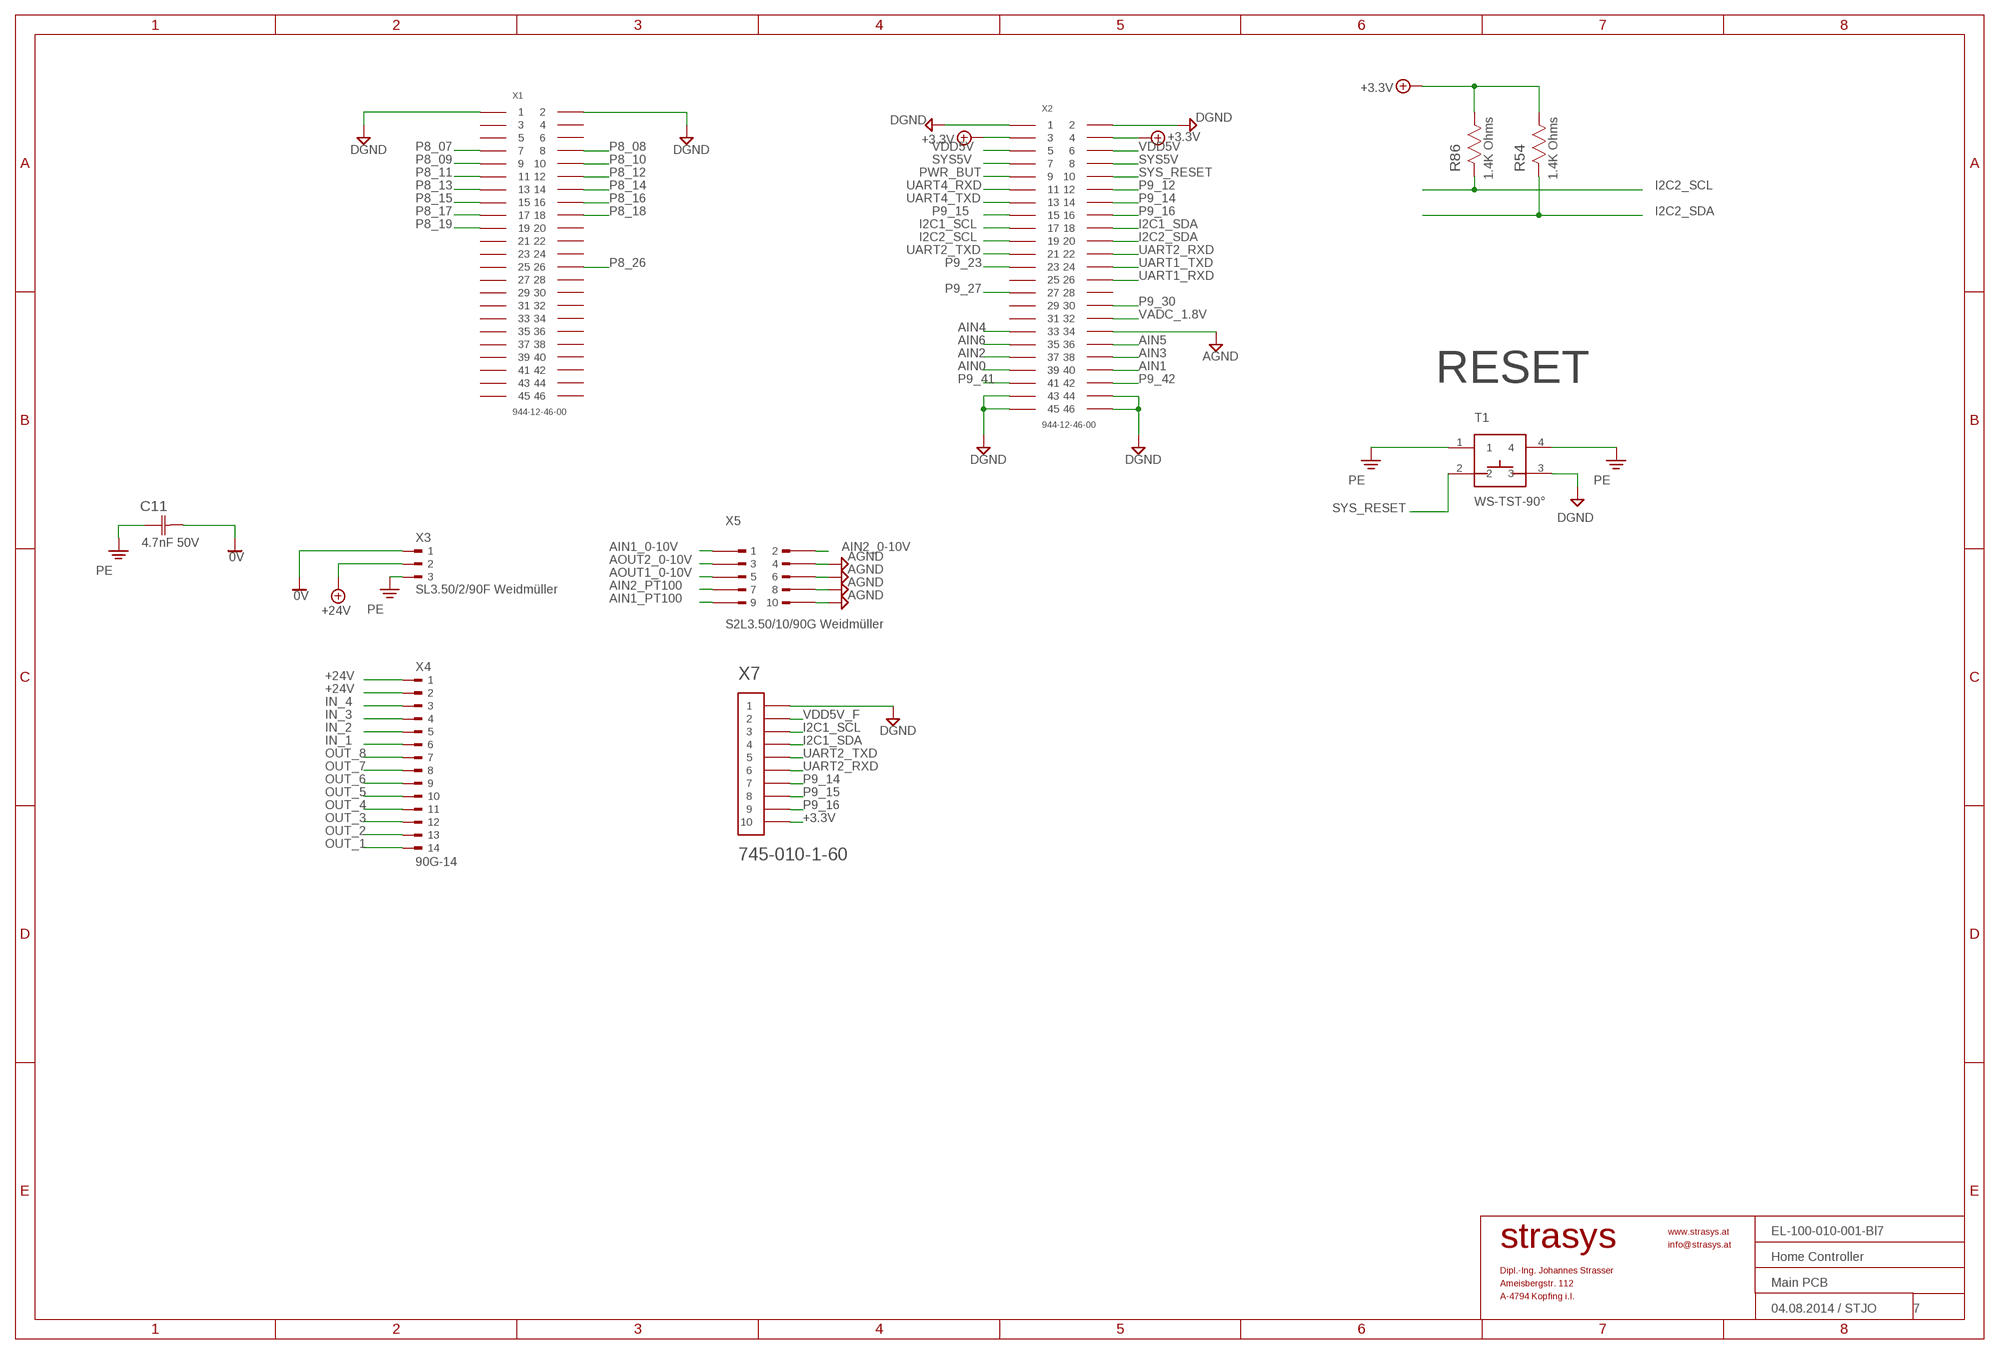
[diagram p6: schematic, sheet 7]
FRAME3 (A3L-LOC): DATE_DRAWING: 04.08.2014 / STJO; DRAWING_NAME1: Home Controller; DRAWING_NAME2: Main PCB; DRAWING_NO: EL-100-010-001-Bl7; PAGE: 7

### Parts
C11  4.7nF 50V  C0603C472K5RACTU  [CAPC1608X85N]
R54  1.4K Ohms  CRCW06031K40FKEA  [RESC1608X60N]
R86  1.4K Ohms  CRCW06031K40FKEA  [RESC1608X60N]
T1  WS-TST-90°  [WS-TST-90°]
X1  944-12-46-00  [2,54_STIFTLEIST_2X23]
X2  944-12-46-00  [2,54_STIFTLEIST_2X23]
X3  SL3.50/2/90F Weidmüller  90F-3  [90F-3]
X4  90G-14  [90G-14]
X5  S2L3.50/10/90G Weidmüller  S2L3.50/10/90G  [S2L-90G-10]
X7  745-010-1-60  [2MM-1-REIH-10]

### Nets
0V: C11.2(C2) X3.1 ; also sheet 1,2
+3.3V: R54.1 R86.1 X2.P3 X2.P4 X7.10 ; also sheet 2,3,5,6
+24V: X3.2 X4.1 X4.2 ; also sheet 1
AGND: X2.P34 X5.4 X5.6 X5.8 X5.10 ; also sheet 3,4
AIN0: X2.P39 ; also sheet 4
AIN1: X2.P40 ; also sheet 4
AIN1_0-10V: X5.1 ; also sheet 3
AIN1_PT100: X5.9 ; also sheet 4
AIN2: X2.P37 ; also sheet 3
AIN2_0-10V: X5.2 ; also sheet 3
AIN2_PT100: X5.7 ; also sheet 4
AIN3: X2.P38 ; also sheet 3
AIN4: X2.P33
AIN5: X2.P36
AIN6: X2.P35
AOUT1_0-10V: X5.5 ; also sheet 3
AOUT2_0-10V: X5.3 ; also sheet 3
DGND: T1.3 X1.P1 X1.P2 X2.P1 X2.P2 X2.P43 X2.P44 X2.P45 X2.P46 X7.1 ; also sheet 1,2,3,5,6
I2C1_SCL: X2.P17 X7.3
I2C1_SDA: X2.P18 X7.4
I2C2_SCL: R86.2 X2.P19 ; also sheet 3,6
I2C2_SDA: R54.2 X2.P20 ; also sheet 3,6
IN_1: X4.6 ; also sheet 2
IN_2: X4.5 ; also sheet 2
IN_3: X4.4 ; also sheet 2
IN_4: X4.3 ; also sheet 2
OUT_1: X4.14 ; also sheet 1
OUT_2: X4.13 ; also sheet 1
OUT_3: X4.12 ; also sheet 1
OUT_4: X4.11 ; also sheet 1
OUT_5: X4.10 ; also sheet 1
OUT_6: X4.9 ; also sheet 1
OUT_7: X4.8 ; also sheet 1
OUT_8: X4.7 ; also sheet 1
P8_07: X1.P7 ; also sheet 1
P8_08: X1.P8 ; also sheet 1
P8_09: X1.P9 ; also sheet 1
P8_10: X1.P10 ; also sheet 1
P8_11: X1.P11 ; also sheet 1
P8_12: X1.P12 ; also sheet 1
P8_13: X1.P13 ; also sheet 1
P8_14: X1.P14 ; also sheet 1
P8_15: X1.P15 ; also sheet 2
P8_16: X1.P16 ; also sheet 2
P8_17: X1.P17 ; also sheet 2
P8_18: X1.P18 ; also sheet 2
P8_19: X1.P19 ; also sheet 6
P8_26: X1.P26 ; also sheet 5
P9_12: X2.P12 ; also sheet 5
P9_14: X2.P14 X7.7
P9_15: X2.P15 X7.8
P9_16: X2.P16 X7.9
P9_23: X2.P23
P9_27: X2.P27
P9_30: X2.P30
P9_41: X2.P41
P9_42: X2.P42
PE: C11.1(C1) T1.1 T1.4 X3.3 ; also sheet 3,4,5
PWR_BUT: X2.P9
SYS5V: X2.P7 X2.P8
SYS_RESET: T1.2 X2.P10
UART1_RXD: X2.P26 ; also sheet 5
UART1_TXD: X2.P24 ; also sheet 5
UART2_RXD: X2.P22 X7.6
UART2_TXD: X2.P21 X7.5
UART4_RXD: X2.P11
UART4_TXD: X2.P13
VADC_1.8V: X2.P32 ; also sheet 4
VDD5V: X2.P5 X2.P6 ; also sheet 5
VDD5V_F: X7.2 ; also sheet 3,4,5
Unconnected: X1.P3 X1.P4 X1.P5 X1.P6 X1.P20 X1.P21 X1.P22 X1.P23 X1.P24 X1.P25 X1.P27 X1.P28 X1.P29 X1.P30 X1.P31 X1.P32 X1.P33 X1.P34 X1.P35 X1.P36 X1.P37 X1.P38 X1.P39 X1.P40 X1.P41 X1.P42 X1.P43 X1.P44 X1.P45 X1.P46 X2.P25 X2.P28 X2.P29 X2.P31

### Notes on the sheet
- RESET

## Library data of the parts
ANT1 = discrete:ANTENNA: Antenna; OC_FARNELL: unknown
BAT1 = strasys_standard:BATTERY_COIN_CLIP: Battery Coin Holder 16mm For 16 mm battery coins; MF: KEYSTONE; MPN: 3013; OC_FARNELL: 1650698; PACKAGE: 16mm; SUPPLIER: Keystone
C1 C25 = strasys_standard:EEE-: Aluminum Electrolytic Capacitors,Surface Mount Type; MF: PANASONIC; MPN: EEEFK1H470P; OC_FARNELL: 9695931; OC_NEWARK: 96K9397; PACKAGE: CASE-E; SUPPLIER: PANASONIC; TOLERANCE: ±20 %; VALUE: 47UF; VOLTAGERATING: 50V
C2 C24 C26 C27 C30-C32 C41 C47-C49 C53 = Kemet_By_element14_Batch_1:C0603C104K5RAC-TU: CAPACITOR, 0603; MF: KEMET; MPN: C0603C104K5RACTU; OC_FARNELL: 1288255; SUPPLIER: Kemet; TOLERANCE: ±10%; VOLTAGERATING: 50V
C3-C10 C15-C18 = Kemet_By_element14_Batch_1:C0603C103K5RACTU: CAPACITOR, 0603; MF: KEMET; MPN: C0603C103K5RACTU; OC_FARNELL: 1414609; OC_NEWARK: 30C5334; SUPPLIER: Kemet; TOLERANCE: ±10%; VALUE: 10nF; VOLTAGERATING: 50V
C11 = Kemet_By_element14_Batch_1:C0603C472K5RACTU: CAPACITOR, 0603; MF: KEMET; MPN: C0603C472K5RACTU; OC_FARNELL: 1414642; OC_NEWARK: 64K2865; SUPPLIER: Kemet; TOLERANCE: ±10%; VALUE: 4.7nF; VOLTAGERATING: 50V
C12 = Kemet_By_element14_Batch_1:C0805C106K8PACTU: CAPACITOR, 0805; MF: KEMET; MPN: C0805C106K8PACTU; OC_FARNELL: 1463362; OC_NEWARK: 70K9138; SUPPLIER: Kemet; TOLERANCE: ±10%; VALUE: 10uF; VOLTAGERATING: 10V
C13 = Kemet_By_element14_Batch_1:C1206C106K3PACTU: CAPACITOR, 1206; MF: KEMET; MPN: C1206C106K3PACTU; OC_FARNELL: 1288206; OC_NEWARK: 88K0222; SUPPLIER: Kemet; TOLERANCE: ±10%; VALUE: 10uF; VOLTAGERATING: 25V
C14 = Kemet_By_element14_Batch_1:C0603C221J5GACTU: CAPACITOR, 0603; MF: KEMET; MPN: C0603C221J5GACTU; OC_FARNELL: 1414623; OC_NEWARK: 64K2847; SUPPLIER: Kemet; TOLERANCE: ±5%; VALUE: 220pF; VOLTAGERATING: 50V
C19-C22 C33 C34 C42 C45 = supply2:C1206C102KDRACTU: Capacitor 1206; MF: KEMET; MPN: C1206C102KDRACTU; OC_FARNELL: 1826304; SUPPLIER: Kemet; TOLERANCE: +/- 10%; VALUE: 1000pF; VOLTAGE_RATING: 1000V
C23 = Kemet_By_element14_Batch_1:C0603C223K5RACTU: CAPACITOR, 0603; MF: KEMET; MPN: C0603C223K5RACTU; OC_FARNELL: 1414625; OC_NEWARK: 03C3260; SUPPLIER: Kemet; TOLERANCE: ±10%; VALUE: 22nF; VOLTAGERATING: 50V
C28 C29 C52 = Kemet_By_element14_Batch_1:C0603C101J5GACTU: CAPACITOR, 0603; MF: KEMET; MPN: C0603C101J5GACTU; OC_FARNELL: 1414603; OC_NEWARK: 64K2833; SUPPLIER: Kemet; TOLERANCE: ±5%; VOLTAGERATING: 50V
C35 C36 C46 = supply2:C1206C102KDRACTU: Capacitor 1206; MF: KEMET; MPN: C1206C102KDRACTU; OC_FARNELL: 1826304; SUPPLIER: Kemet; TOLERANCE: +/- 10%; VOLTAGE_RATING: 1000V
C37 C38 = Kemet_By_element14_Batch_1:C0603C823K5RACTU: CAPACITOR, 0603; MF: KEMET; MPN: C0603C823K5RACTU; OC_FARNELL: 1865539; OC_NEWARK: 29T9054; SUPPLIER: KEMET; TOLERANCE: ±10%; VOLTAGERATING: 50V
C39 C40 C43 C44 = Kemet_By_element14_Batch_1:C0603C181J2GACTU: CAPACITOR, 0603; MF: KEMET; MPN: C0603C181J2GACTU; OC_FARNELL: 1865524; OC_NEWARK: 29T8996; SUPPLIER: KEMET; TOLERANCE: ±5%; VOLTAGERATING: 200V
C50 = Kemet_By_element14_Batch_1:C0603C120J5GACTU: CAPACITOR, 0603; MF: KEMET; MPN: C0603C120J5GACTU; OC_FARNELL: 1414612; OC_NEWARK: 19C1214; SUPPLIER: Kemet; TOLERANCE: ±5%; VOLTAGERATING: 50V
C51 = Kemet_By_element14_Batch_1:C0603C100J5GACTU: CAPACITOR, 0603; MF: KEMET; MPN: C0603C100J5GACTU; OC_FARNELL: 1414601; OC_NEWARK: 64K2831; SUPPLIER: Kemet; TOLERANCE: ±5%; VOLTAGERATING: 50V
D1 = diode:SCHOTTKY-DIODE: Schottky Diode; MF: BOURNS; MPN: CD214B-B220LF; OC_FARNELL: 2311235; SUPPLIER: Bourns
D2 D4 = strasys_standard:BYM11: BYM11 Switching Rectifier Vishay; MF: VISHAY; MPN: BYM11-1000-E3/96; OC_FARNELL: 1336518; PACKAGE: DO-213AB; SUPPLIER: Vishay
D3 = WE-TVS_8240136:WE-TVS_8240136: TVS Diode Array WE-TVS, High Speed Series - Low capazity - No leakage current - Low clamping voltage - high ESD voltage protection -- 3.3 VDC Application; MF: WURTH ELEKTRONIK; MPN: 8240136; OC_FARNELL: 1825870; OC_NEWARK: 79R6951; PACKAGE: SOT143-4L; SUPPLIER: Wuerth Elektronik
D5 = strasys_standard:SM15T: TVS - Diode SM15T series unidirectional; MF: STMICROELECTRONICS; MPN: SM15T39A; OC_FARNELL: 9802606; PACKAGE: DO-214AB; SUPPLIER: STMICROELECTRONICS
L1 = WE-PD:WE-PD: SMD-Shielded Power Inductors WE-PD - Magnetically shielded version which results in a low leakage field - High storage capacity - Low self-losses - Highest possible current loading for SMD-Inducors -- Switching regulators with low operating voltages (computer, laptop, mobile phones, pagers) -- Integrated DC/DC-converter -- Is recommended for the application with switching regulators from National Semiconductor, Linear Technology, Texas Instruments and Fairchild Semiconductor, ect. -- Graphic cards -- Plastic base: Because of the one piece construction these are more suitable for high vibration or shock applications; MF: WURTH ELEKTRONIK; MPN: 7447779006; OC_FARNELL: 1635987; OC_NEWARK: 08P2857; PACKAGE: 7345; SUPPLIER: Wuerth Elektronik
L2 = WE-CBF:WE-CBF: SMD EMI Suppression Ferrite Beads WE-CBF - Excellent anti-EMI properties - Low DC-restistance - Impedances till 3000 ohms - Rated current up to 6 A -- Reliable Ni-Sn electrodes -- Perfect as data lined filter and for uncoupling of distribution voltage; MF: WURTH ELEKTRONIK; MPN: 74279218; OC_FARNELL: 1635758; OC_NEWARK: 08P2403; PACKAGE: IND-1206; SUPPLIER: Wuerth Elektronik
L3 L4 = WE-CBF:WE-CBF: SMD EMI Suppression Ferrite Beads WE-CBF - Excellent anti-EMI properties - Low DC-restistance - Impedances till 3000 ohms - Rated current up to 6 A -- Reliable Ni-Sn electrodes -- Perfect as data lined filter and for uncoupling of distribution voltage; MF: WURTH ELEKTRONIK; MPN: 74279263; OC_FARNELL: 1635689; OC_NEWARK: 08P2434; PACKAGE: IND-0603; SUPPLIER: Wuerth Elektronik
LED1-LED9 LED14-LED17 = strasys_standard:KP-1608QBC-D-LED: KP-1608QBC-D-LED Chip LED SMD Package 0603 BLUE; MF: KINGBRIGHT; MPC: KP-1608QBC-D-LED; MPN: KP-1608QBC-D; OC_FARNELL: 2217972; SUPPLIER: Kingbright
OC1-OC8 OC13-OC16 = strasys_standard:TCMT1106: OPTOKOPPLER 1-Kanal Optokoppler Gehäuse: SOP-4; MANUFACTURER: Vishay; MF: VISHAY; MPN: TCMT1106; OC_FARNELL: 2251262; PACKAGE: SOP-4
PTC1 = strasys_standard:MF-PSMF: MF-PSMF Series PTC resetable Fuses Manufacturer Bourns Size: 0805; HOLD_CURRENT: 750 mA; MF: BOURNS; MPN: MF-PSMF075X-2; OC_FARNELL: 1961498; PACKAGE: 0805; SUPPLIER: Bourns
R1-R8 R40 R41 R46-R49 R87 = Vishay_By_element14_Batch_1:CRCW06031K00FKEA: RESISTOR, 0603; MF: VISHAY DRALORIC; MPN: CRCW06031K00FKEA; OC_FARNELL: 1469740; OC_NEWARK: 52K8015; SUPPLIER: Vishay; TOLERANCE: ± 1.0 %; WATTAGE: 0.1W
R9 R18-R25 R50-R53 R55 R83 = Vishay_By_element14_Batch_1:CRCW060310K0FKEA: RESISTOR, 0603; MF: VISHAY DRALORIC; MPN: CRCW060310K0FKEA; OC_FARNELL: 1469748; OC_NEWARK: 52K8062; SUPPLIER: Vishay; TOLERANCE: ± 1.0 %; WATTAGE: 0.1W
R10-R17 = Vishay_By_element14_Batch_1:CRCW060347K0FKEA: RESISTOR, 0603; MF: VISHAY DRALORIC; MPN: CRCW060347K0FKEA; OC_FARNELL: 1469811; OC_NEWARK: 52K8548; SUPPLIER: Vishay; TOLERANCE: ± 1.0 %; WATTAGE: 0.1W
R26 = Vishay_By_element14_Batch_1:CRCW060386K6FKEA: RESISTOR, 0603; MF: VISHAY DRALORIC; MPN: CRCW060386K6FKEA; OC_FARNELL: 1652901; OC_NEWARK: 52K8751; SUPPLIER: Vishay; TOLERANCE: ± 1.0 %; WATTAGE: 0.1W
R27 = Vishay_By_element14_Batch_1:CRCW060310K2FKEA: RESISTOR, 0603; MF: VISHAY DRALORIC; MPN: CRCW060310K2FKEA; OC_FARNELL: 1652829; OC_NEWARK: 52K8067; SUPPLIER: Vishay; TOLERANCE: ± 1.0 %; WATTAGE: 0.1W
R28 R34-R37 R39 R42-R45 R56-R59 R82 R84 R85 = Vishay_By_element14_Batch_1:CRCW06034K70FKEA: RESISTOR, 0603; MF: VISHAY DRALORIC; MPN: CRCW06034K70FKEA; OC_FARNELL: 1469807; OC_NEWARK: 52K8494; SUPPLIER: Vishay; TOLERANCE: ± 1.0 %; WATTAGE: 0.1W
R29 = Vishay_By_element14_Batch_1:CRCW06031M00FKEA: RESISTOR, 0603; MF: VISHAY DRALORIC; MPN: CRCW06031M00FKEA; OC_FARNELL: 1469746; OC_NEWARK: 52K8053; SUPPLIER: Vishay; TOLERANCE: ± 1.0 %; WATTAGE: 0.1W
R30 R66 R67 R88 = Vishay_By_element14_Batch_1:CRCW12060000Z0EA: RESISTOR, 1206; MF: VISHAY DRALORIC; MPN: CRCW12060000Z0EA; OC_FARNELL: 1469963; OC_NEWARK: 53K1778; SUPPLIER: Vishay; TOLERANCE: -; WATTAGE: 0.25W
R31 R38 = Vishay_By_element14_Batch_1:CRCW06035K10FKEA: RESISTOR, 0603; MF: VISHAY DRALORIC; MPN: CRCW06035K10FKEA; OC_FARNELL: 1469819; OC_NEWARK: 52K8571; SUPPLIER: Vishay; TOLERANCE: ± 1.0 %; WATTAGE: 0.1W
R32 R33 = Vishay_By_element14_Batch_1:CRCW060315K0FKEA: RESISTOR, 0603; MF: VISHAY DRALORIC; MPN: CRCW060315K0FKEA; OC_FARNELL: 1469758; OC_NEWARK: 42K3721; SUPPLIER: Vishay; TOLERANCE: ± 1.0 %; WATTAGE: 0.1W
R54 R86 = Vishay_By_element14_Batch_1:CRCW06031K40FKEA: RESISTOR, 0603; MF: VISHAY DRALORIC; MPN: CRCW06031K40FKEA; OC_FARNELL: 1469742; OC_NEWARK: 52K8034; SUPPLIER: Vishay; TOLERANCE: ± 1.0 %; WATTAGE: 0.1W
R60 R62 = Vishay_By_element14_Batch_1:CRCW0603590RFKEA: RESISTOR, 0603; MF: VISHAY DRALORIC; MPN: CRCW0603590RFKEA; OC_FARNELL: 2141350; OC_NEWARK: 52K8633; SUPPLIER: VISHAY DALE ELECTRONICS; TOLERANCE: ±1%; WATTAGE: 0.1 W
R61 R63 = Vishay_By_element14_Batch_1:CRCW0603536RFKEA: RESISTOR, 0603; MF: VISHAY DALE; MPN: CRCW0603536RFKEA; OC_FARNELL: 1152068; OC_NEWARK: 52K8609; SUPPLIER: VISHAY DALE ELECTRONICS; TOLERANCE: ±1%; WATTAGE: 0.1 W
R64 R65 = Vishay_By_element14_Batch_1:CRCW060349R9FKEA: RESISTOR, 0603; MF: VISHAY DRALORIC; MPN: CRCW060349R9FKEA; OC_FARNELL: 1469817; OC_NEWARK: 52K8566; SUPPLIER: Vishay; TOLERANCE: ± 1.0 %; WATTAGE: 0.1W
R68 R71 = Vishay_By_element14_Batch_1:CRCW0603604RFKEA: RESISTOR, 0603; MF: VISHAY DRALORIC; MPN: CRCW0603604RFKEA; OC_FARNELL: 1652895; OC_NEWARK: 52K8646; SUPPLIER: Vishay; TOLERANCE: ± 1.0 %; WATTAGE: 0.1W
R69 R70 = Vishay_By_element14_Batch_1:CRCW0603392RFKEA: RESISTOR, 0603; MF: VISHAY DALE; MPN: CRCW0603392RFKEA; OC_FARNELL: 1354328; OC_NEWARK: 52K8482; SUPPLIER: VISHAY DALE ELECTRONICS; TOLERANCE: ±1%; WATTAGE: 0.1 W
R72 R77 = Vishay_By_element14_Batch_1:CRCW06031K78FKEA: RESISTOR, 0603; MF: VISHAY DALE; MPN: CRCW06031K78FKEA; OC_FARNELL: 1157174; OC_NEWARK: 42K3651; SUPPLIER: VISHAY DALE ELECTRONICS; TOLERANCE: ±1%; WATTAGE: 0.1 W
R73 R78 = Vishay_By_element14_Batch_1:CRCW06038K66FKEA: RESISTOR, 0603; MF: VISHAY DALE; MPN: CRCW06038K66FKEA; OC_FARNELL: 1152136; OC_NEWARK: 52K8729; SUPPLIER: VISHAY DALE ELECTRONICS; TOLERANCE: ±1%; WATTAGE: 0.1 W
R74 R80 = Vishay_By_element14_Batch_1:CRCW060382K5FKEA: RESISTOR, 0603; MF: VISHAY DRALORIC; MPN: CRCW060382K5FKEA; OC_FARNELL: 1469840; OC_NEWARK: 52K8737; SUPPLIER: Vishay; TOLERANCE: ± 1.0 %; WATTAGE: 0.1W
R75 R79 = Vishay_By_element14_Batch_1:CRCW0603453RFKEA: RESISTOR, 0603; MF: VISHAY DALE; MPN: CRCW0603453RFKEA; OC_FARNELL: 1364709; OC_NEWARK: 52K8540; SUPPLIER: VISHAY DALE ELECTRONICS; TOLERANCE: ±1%; WATTAGE: 0.1 W
R76 R81 = Vishay_By_element14_Batch_1:CRCW0603210KFKEA: RESISTOR, 0603; MF: VISHAY DRALORIC; MPN: CRCW0603210KFKEA; OC_FARNELL: 2138527; OC_NEWARK: 52K8281; SUPPLIER: VISHAY DALE ELECTRONICS; TOLERANCE: ±1%; WATTAGE: 0.1 W
R89 = Vishay_By_element14_Batch_1:CRCW060351K0FKEA: RESISTOR, 0603; MF: VISHAY DRALORIC; MPN: CRCW060351K0FKEA; OC_FARNELL: 1469822; OC_NEWARK: 52K8588; SUPPLIER: Vishay; TOLERANCE: ± 1.0 %; WATTAGE: 0.1W
RF1 = strasys_standard:TX-FM-MID: TX-FM-MID Aurel; MF: AUREL; MPN: TX MID 3V; OC_FARNELL: 1699470; SUPPLIER: Aurel
RV1 = WE-VS:WE-VS: WESURGE SMD Varistor WE-VS - Fast response time - Low leakage current - Low clamping voltage - Wide range of voltage avaible - Almost no energy consumption in stand-by mode - Excellent absorption at surge-impulses - Nickel barrier for leadfree soldering - Operating temperature: -40°C to +85°C for size 0402 to 0805; -40°C to +1255°C for size 1206 to 2220 -- Protection of DC distribution -- Protection of power supply -- Protection of semiconductors -- Protection of bus systems and communication lines -- Limiting of over-voltage -- ESD protection in accordance with EN 61000-4-2 and Surge protection in accordance with EN 61000-4-5; MF: WURTH ELEKTRONIK; MPN: 82536140; OC_FARNELL: 1636437; OC_NEWARK: 08P3011; PACKAGE: 0603; SUPPLIER: WURTH ELEKTRONIK
RV2-RV7 = WE-VS:WE-VS: WESURGE SMD Varistor WE-VS - Fast response time - Low leakage current - Low clamping voltage - Wide range of voltage avaible - Almost no energy consumption in stand-by mode - Excellent absorption at surge-impulses - Nickel barrier for leadfree soldering - Operating temperature: -40°C to +85°C for size 0402 to 0805; -40°C to +1255°C for size 1206 to 2220 -- Protection of DC distribution -- Protection of power supply -- Protection of semiconductors -- Protection of bus systems and communication lines -- Limiting of over-voltage -- ESD protection in accordance with EN 61000-4-2 and Surge protection in accordance with EN 61000-4-5; MF: WURTH ELEKTRONIK; MPN: 82536140; OC_FARNELL: 1636437; OC_NEWARK: 08P3014; PACKAGE: 0603; SUPPLIER: WURTH ELEKTRONIK
T1 = strasys_standard:WS-TST-90°: Tact Switch Tact switch series WE-TST 90° type; MF: WURTH ELEKTRONIK; MPN: 431256038726; OC_FARNELL: 2065135; SUPPLIER: Wuerth Electronic
TP1-TP5 = testpad:TP: Test pad; OC_FARNELL: unknown
U1 U2 = strasys_standard:VNI4140K: Quad high-side smart power solid-state relay,power SSO-24; MF: STMICROELECTRONICS; MPN: VNI4140K-32; OC_FARNELL: 2309423; OC_MOUSER: 511-VNI4140KTR-32; PACKAGE: SO-24; SUPPLIER: STMICROELECTRONICS
U3 = strasys_standard:LMR62421XSD: IC, SIMPLE SWITCHER 24Vout, 2.1A Step-Up Voltage Regulator in WSON-6; MF: TEXAS INSTRUMENTS; MPN: LMR62421XSD; OC_FARNELL: 2064679; OC_NEWARK: 75T7402; PACKAGE: WSON-6; SUPPLIER: TEXAS INSTRUMENTS
U4 U6 = strasys_standard:OPA2170AID: Low-Power OPERATIONAL AMPLIFIERS,SOIC- 8; MF: TEXAS INSTRUMENTS; MPN: OPA2170AID; OC_FARNELL: 2144252; OC_NEWARK: 05W9871; PACKAGE: SOIC- 8; SUPPLIER: TEXAS INSTRUMENTS
U5 = strasys_standard:LTC2635HUD-LMI10PBF: Quad I2C VOUT DACs with 10ppm/°C Reference; MF: LINEAR TECHNOLOGY; MPN: LTC2635HUD-LMI10#PBF; OC_FARNELL: 1839199; OC_NEWARK: 52R9852; PACKAGE: QFN-16; SUPPLIER: Linear Technology
U7 = strasys_standard:OPA2188AIDGKR: OP AMP, GP, RR, 2MHZ, 36-V, Zero-Drift,8MSOP; MF: TEXAS INSTRUMENTS; MPN: OPA2188AIDGKR; OC_FARNELL: 2057091; OC_NEWARK: 61T5955; PACKAGE: 8MSOP; SUPPLIER: TEXAS INSTRUMENTS
U8 = Microchip-MCP7940N-I_SN:MCP7940N-I/SN: I2C™ Real-Time Clock/Calendar with SRAM,SOIC-8; MF: MICROCHIP; MPN: MCP7940N-I/SN; OC_FARNELL: 2361122; OC_NEWARK: 26T2748; PACKAGE: SOIC-8; SUPPLIER: MICROCHIP
U9 = strasys_standard:PMEG2005ET: 500 mA low VF single MEGA Schottky barrier rectifier; MF: NXP; MPN: PMEG2005ET; OC_FARNELL: 1510672; PACKAGE: SOT-23-3; SUPPLIER: NXP
U16 = Microchip_By_element14_Batch_1:24AA256-I/SN: EEPROM; MF: MICROCHIP; MPN: 24AA256-I/SN; OC_FARNELL: 1331295; OC_NEWARK: 92C6874; PACKAGE: SOIC-8; SUPPLIER: MICROCHIP
U17 = strasys_standard:SW-DIL-3: SW-DIL-3; MF: MULTICOMP; MPN: MCEI-03; OC_FARNELL: 1523985; SUPPLIER: Multicomp
U19 = strasys_standard:ABS10: Crystal Frequency: 32.768 kHz Capacitance: 7pF; MF: ABRACON; MPN: ABS10-32.768KHZ-7-T; OC_FARNELL: 2101351; SUPPLIER: ABRACON
X1 X2 = strasys_standard:944-12-46-00: 2.54 mm 2 - reihiger male connector; OC_FARNELL: unknown; SUPPLIER: W+P
X3 = strasys_standard:90F-3: WEIDMUELLER CLAMP CONNECTOR; OC_FARNELL: unknown; SUPPLIER: Weidmüller
X4 = strasys_standard:90G-14: Weidmüller Clamp Connector; OC_FARNELL: unknown; SUPPLIER: Weidmüller
X5 = strasys_standard:S2L3.50/10/90G: OMNIMATE S2L3.50/10/90G Fa. Weidmüller; OC_FARNELL: unknown; SUPPLIER: Weidmüller
X6 = strasys_standard:HD-20: SUB-D 9 female (=Buchse); MF: TE CONNECTIVITY / AMP; MNC: 1734354-1; MPN: 1734354-1.; OC_FARNELL: 1653978; SUPPLIER: TE-Connectivity
X7 = strasys_standard:745-010-1: 2mm Female Header Pitch: 2mm Straigh Single Row 10 contacts; OC_FARNELL: unknown; SUPPLIER: W+P

## Net classes
0 default: clearance 0.205 mm